# EAGLE board RAMBo (EAGLE 6.5.0), part 1 of 2
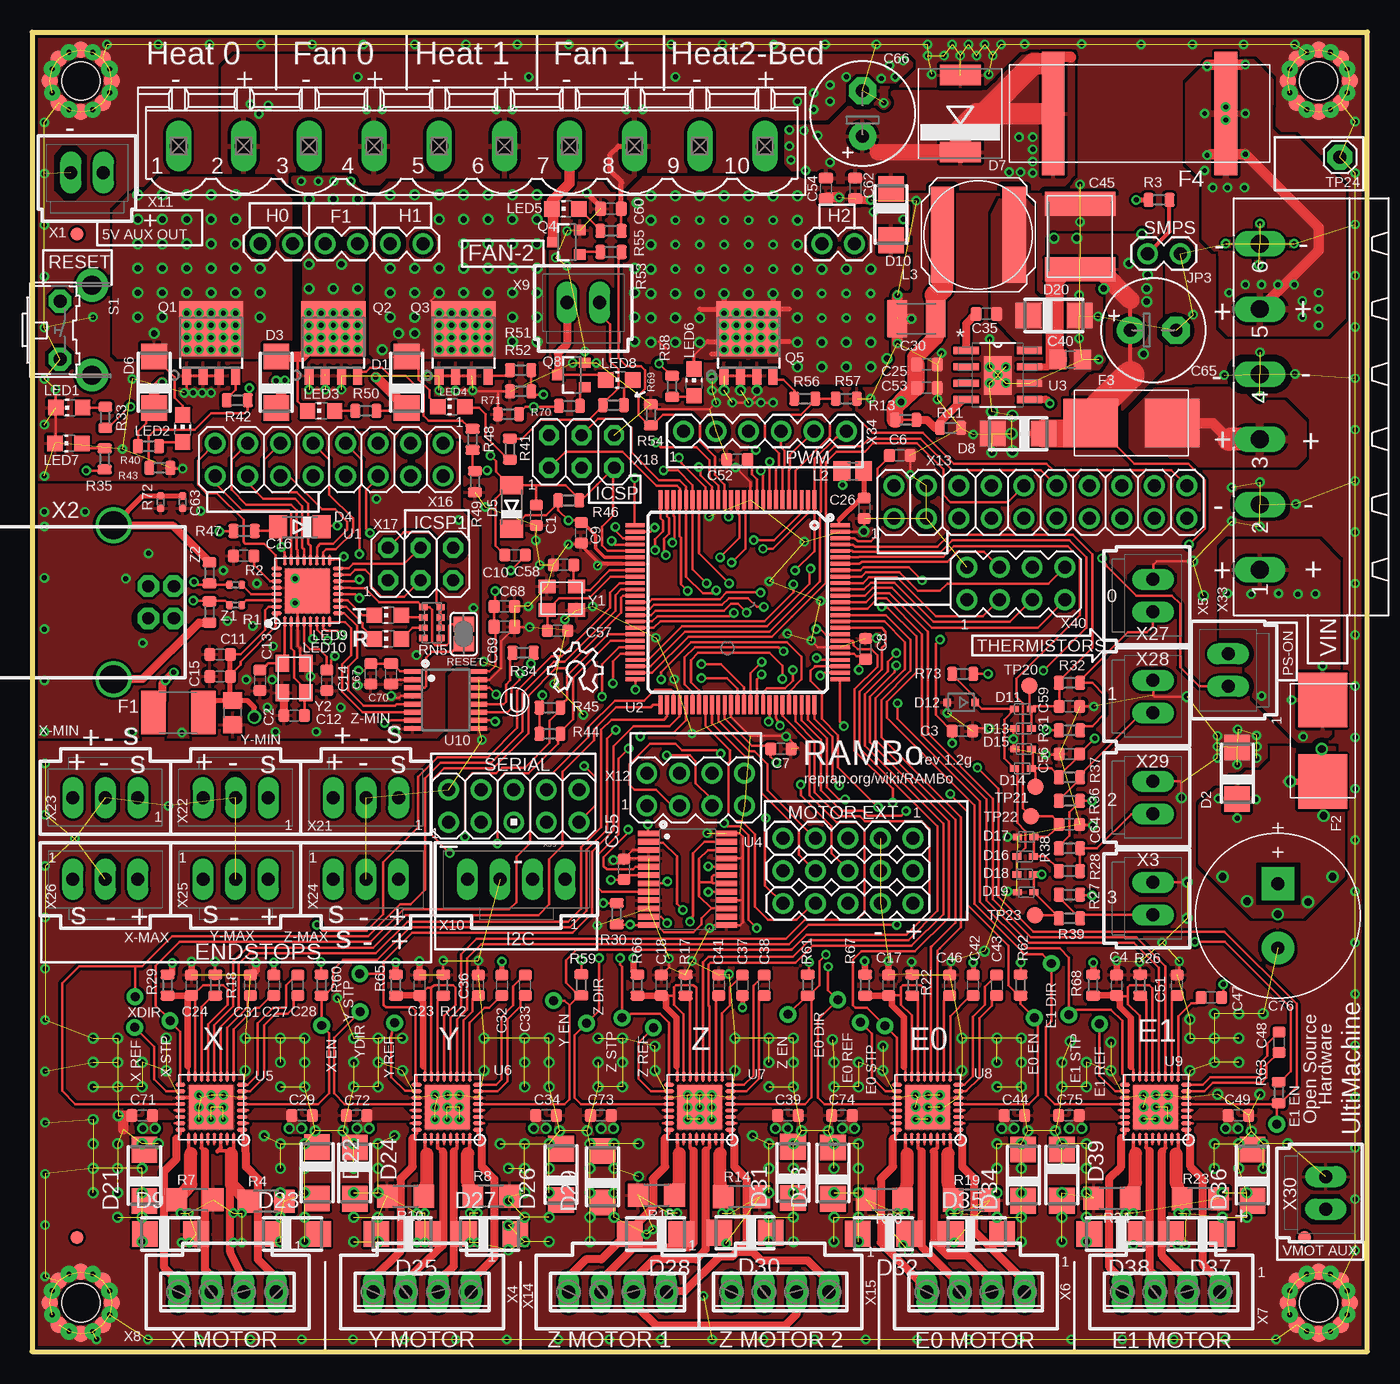
[diagram p2: board, top side]
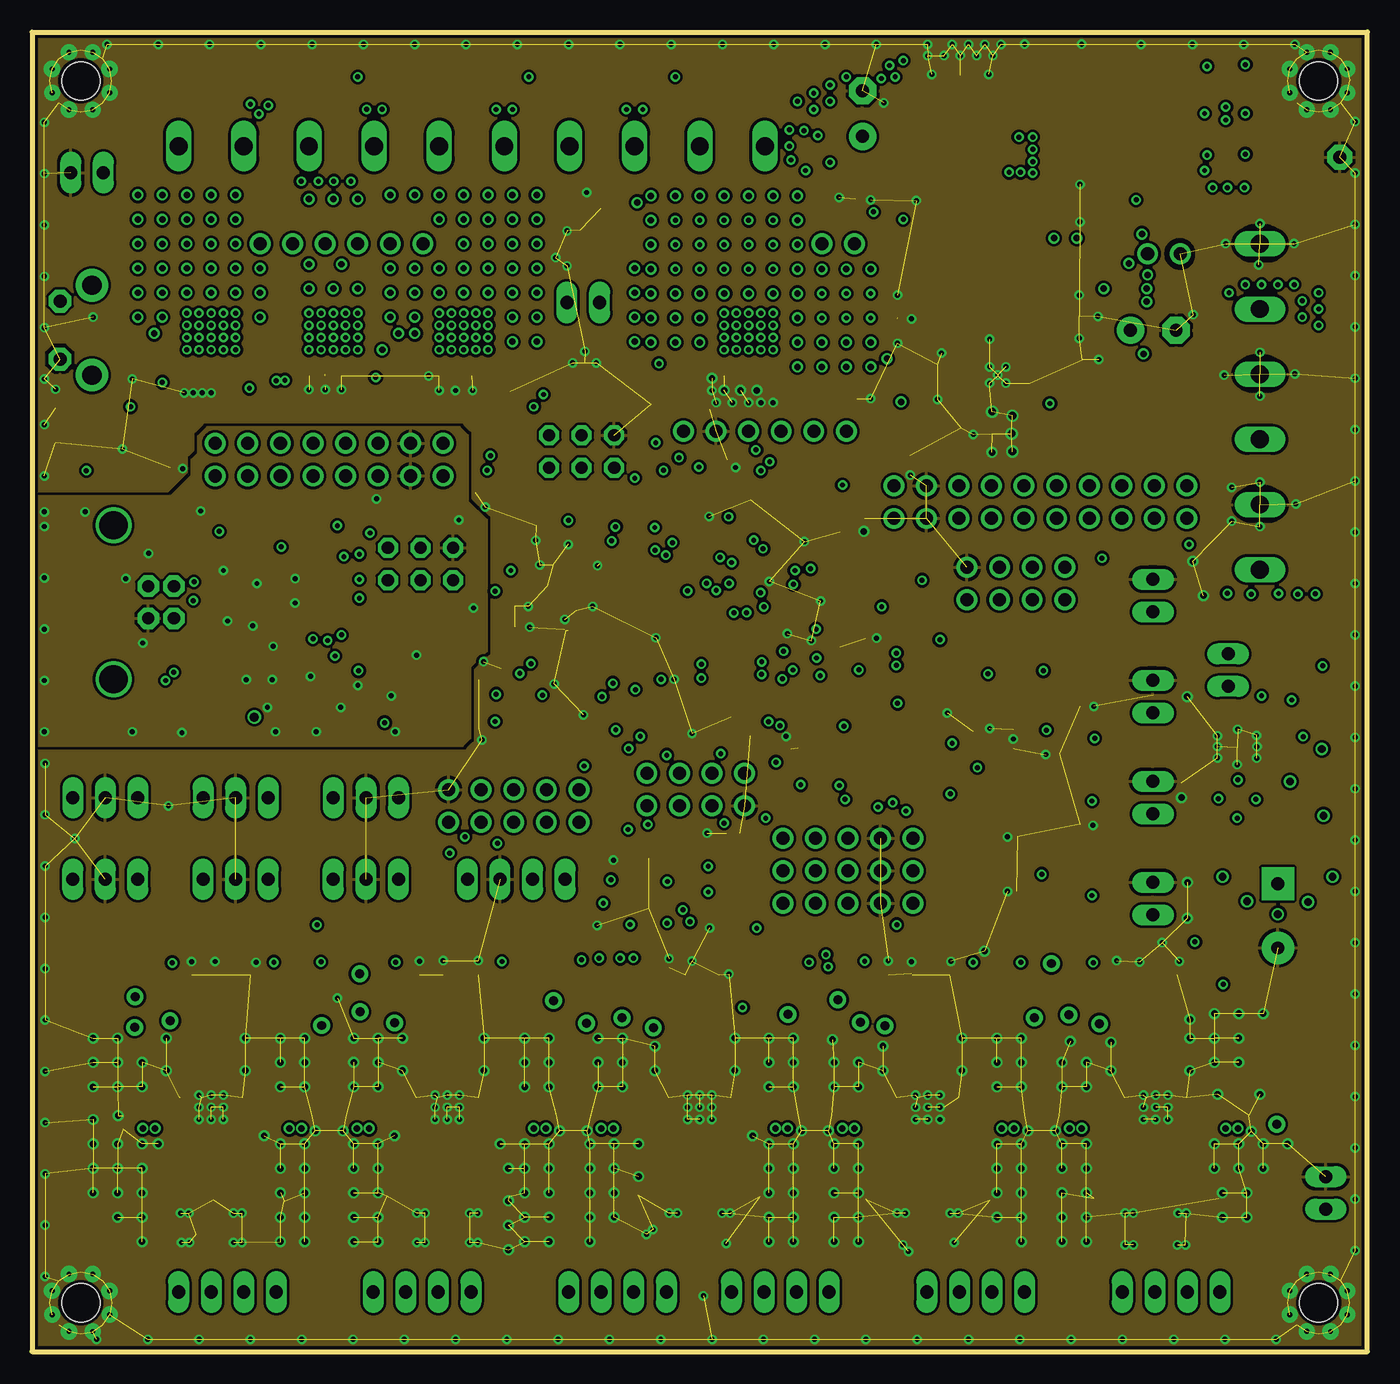
[diagram p3: board, inner layer 2-GND]
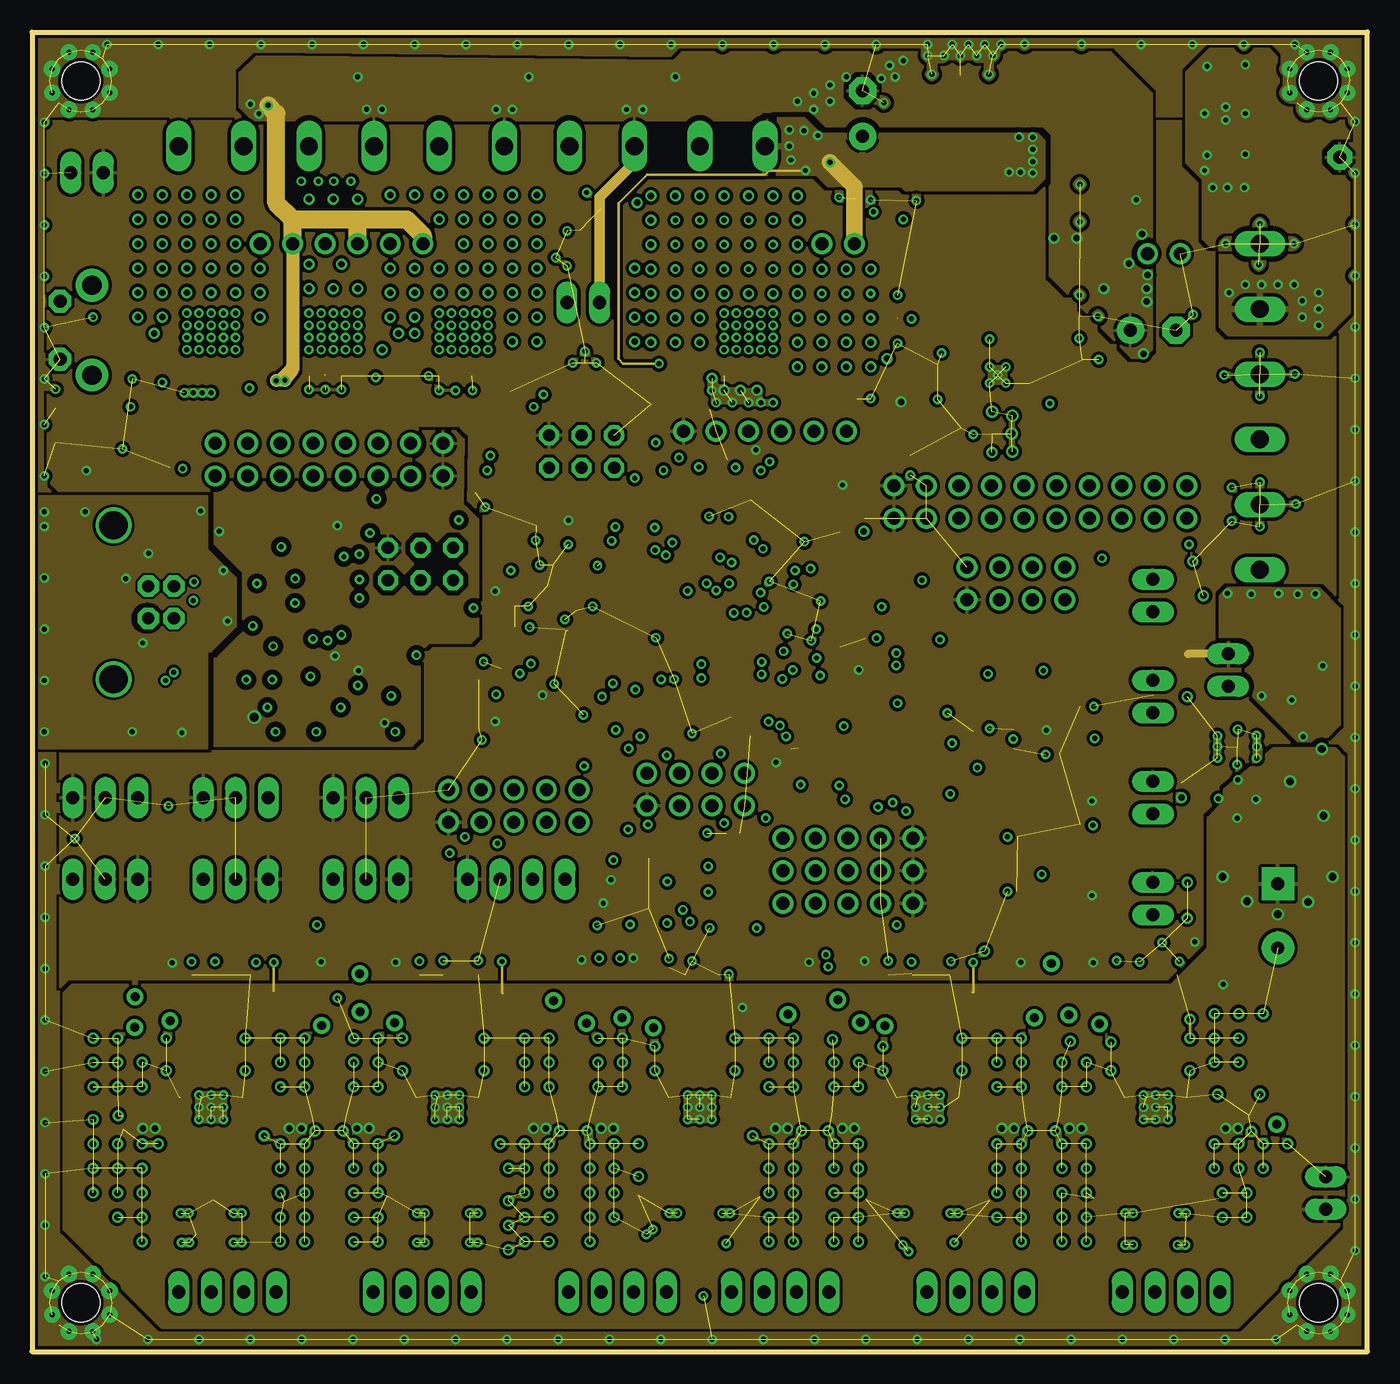
[diagram p4: board, inner layer 15-SUPPLY]
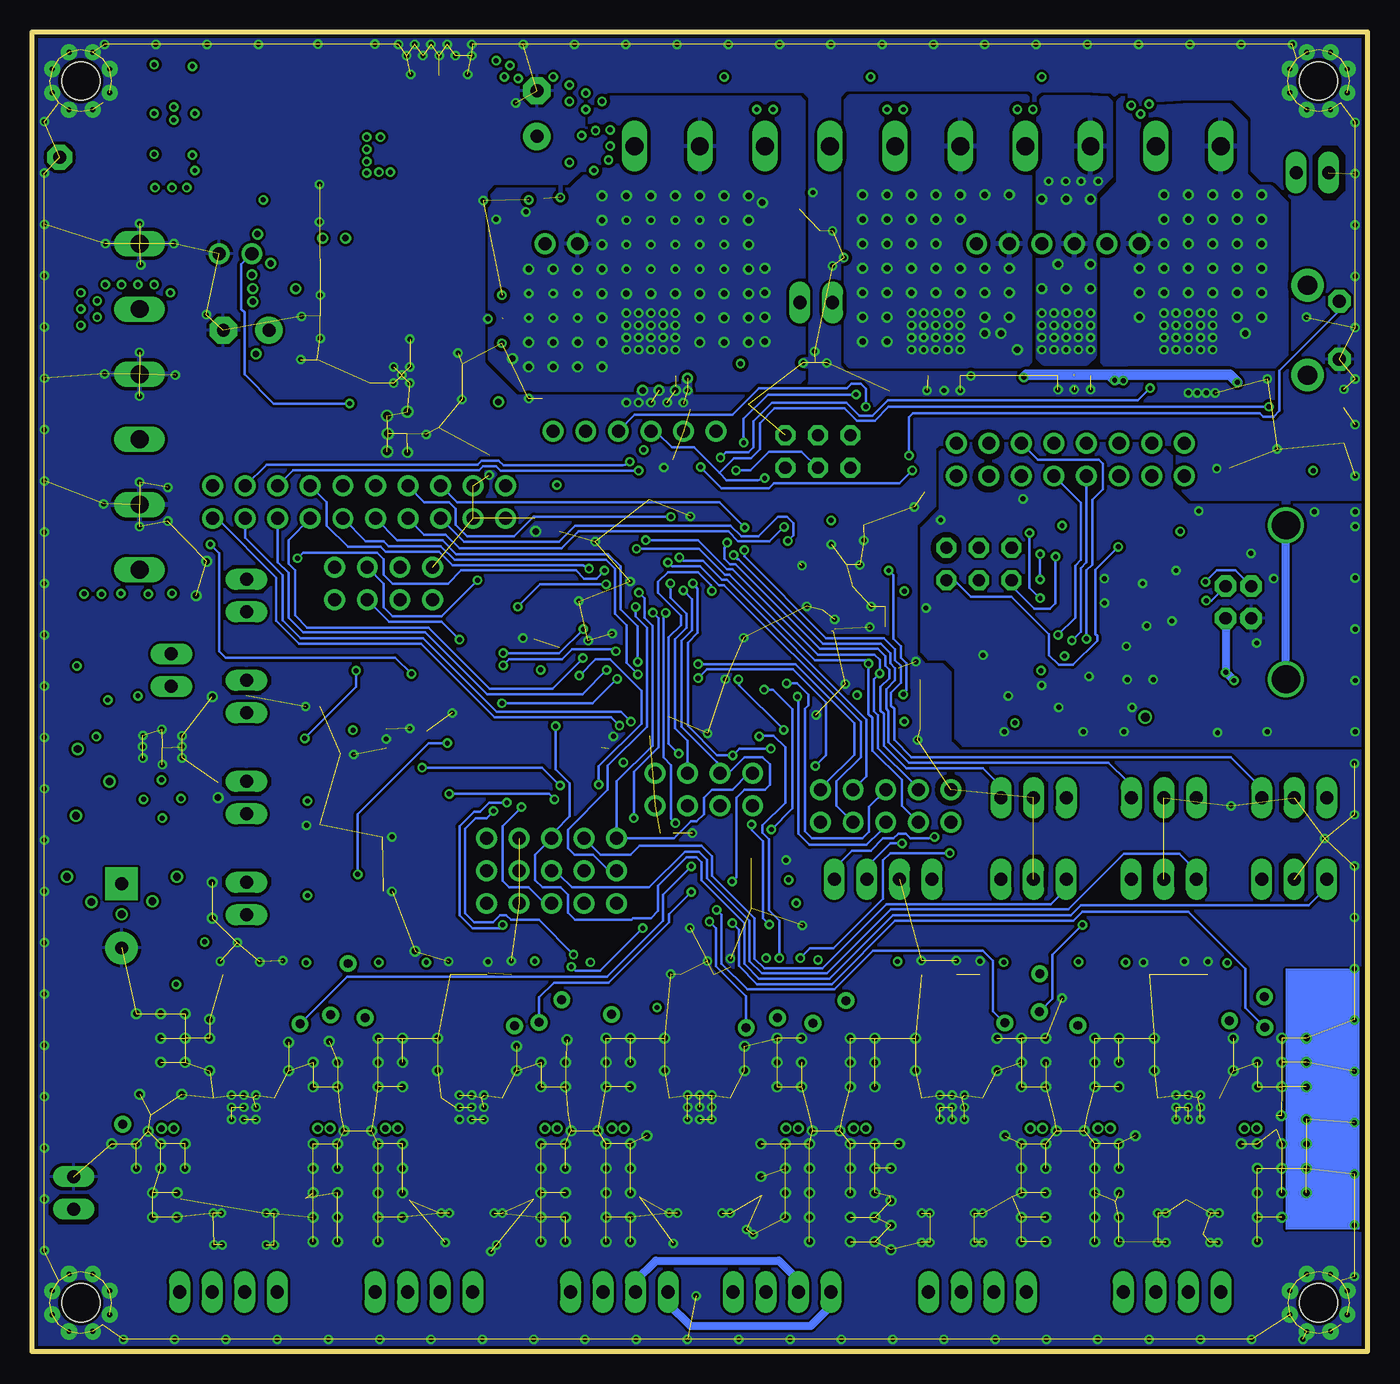
[diagram p5: board, bottom side, seen from below]

Size 104.14 x 102.87 mm. Coordinates in mm from the lower left corner, seen from the top.
Outline: 0,0 104.14,0 104.14,102.87 0,102.87 0,0
Copper layers (1*2+15*16): Top 0.07mm / dielectric 0.6mm / 2-GND 0.035mm / dielectric 0.2mm / 15-SUPPLY 0.035mm / dielectric 0.6mm / Bottom 0.07mm
Design rules "rambo4layer1-2f": minimum track width 7mil, minimum drill 15mil, track to track 7mil, track to pad 7mil, pad to pad 7mil, via to via 7mil, smd to smd 7mil, copper to edge 10mil, drill to drill 8mil, minimum pad ring 12mil, minimum via ring 7mil, stop-mask expansion 3mil, vias tented up to drill 25mil, thermal gap 10mil
Net classes: 0 default: width 0.178 mm, drill 0.381 mm, clearance 0.178 mm; 1 power: width 0.203 mm, drill 0.381 mm, clearance 0.178 mm; 2 gnd: width 0.203 mm, drill 0.381 mm, clearance 0.178 mm; 3 power usb: width 0.203 mm, drill 0.381 mm, clearance 0.178 mm
tRestrict: area 93.5,75 to 98,77.4

## Footprints (pad centres in the part's own frame; a part is rotated, then mirrored left to right if it is on the bottom)
C0603 = smd 0.85 x 1: 1 -0.8,0; 2 0.8,0
C0805 = smd 1.3 x 1.5: 1 -0.95,0; 2 0.95,0
C0603' = smd 0.85 x 1.1: 1 -0.8,0; 2 0.8,0
C1210K = smd 1.5 x 2.9: 1 -1.5,0; 2 1.5,0
C2220K = smd 1.85 x 5.5: 1 -2.55,0; 2 2.55,0
C0402 = smd 0.55 x 0.6: 1 -0.475,0; 2 0.475,0
E3,5-8 = drill 1 pad 2.134: + -1.778,0 | drill 1 pad 2.134 octagon: - 1.778,0
C12,5-5 = drill 1 pad 2.54 square: + 2.5,0 | drill 1 pad 2.54: - -2.5,0
SMA-SM = smd 2 x 2: A 2,0; C -2,0
MINIMELF = smd 1.4 x 1.8: A 1.7,0; C -1.7,0
DO-214AB = smd 1.6 x 3.2: A 3,0; C -3,0
SOD523 = smd 0.7 x 0.5: A 0.7,0; C -0.6,0
SOD323-R = smd 0.6 x 0.6: A 1.1,0; C -1.1,0
L1812 = smd 1.9 x 3.4: 1 -1.95,0; 2 1.95,0
OMNI-BLOK = smd 4.24 x 3.81: P$1 3.185,0; P$2 -3.185,0
FUSE-ATO-SMD = smd 1.778 x 9.652: P$1 -6.731,0; P$2 6.731,0
FIDUCIAL-1X2 = smd 1 x 1: 1 0,0
3,0-WAVE-HOLE = smd 1.27 x 1.27: P$1 0,2.413; P$2 2.413,0; P$3 0,-2.413; P$4 -2.413,0; P$5 1.714,1.714; P$6 -1.714,1.714; P$7 1.714,-1.714; P$8 -1.714,-1.714 | drill 0.381 pad 1.27: P$17 -2.248,0.933; P$18 -0.927,2.242; P$19 0.921,2.242; P$20 2.235,0.927; P$21 2.242,-0.921; P$22 0.927,-2.242; P$23 -0.927,-2.235; P$24 -2.242,-0.921 | hole 3: 0,0
SJ = smd 1.168 x 1.6: 1 -0.762,0; 2 0.762,0
1X02 = drill 1.016: 1 0,0; 2 2.54,0
C0805' = smd 1.3 x 1.5: 1 -0.85,0; 2 0.85,0
NR8040 = smd 1.8 x 7.5: P$1 -2.8,0; P$2 2.8,0
CHIP-LED0805 = smd 1.2 x 1.2: A 0,-1.05; C 0,1.05
SOT669 = smd 0.7 x 1.4: 1 -1.905,-2.55; 2 -0.635,-2.55; 3 0.635,-2.55; 4 1.905,-2.55 | smd 5 x 4.3: MB 0,1.1
SOT23-3 = smd 0.8 x 0.9: 1 -0.95,-1; 2 0.95,-1; 3 0,1.1
R0402 = smd 0.54 x 0.6: 1 -0.48,0; 2 0.48,0
R0603 = smd 0.79 x 1.1: 1 -0.82,0; 2 0.82,0
R1206 = smd 1.6 x 1.803: 1 -1.422,0; 2 1.422,0
CAY16 = smd 0.5 x 0.65: 1 -1.2,-0.675; 2 -0.4,-0.675; 3 0.4,-0.675; 4 1.2,-0.675; 5 1.2,0.675; 6 0.4,0.675; 7 -0.4,0.675; 8 -1.2,0.675
B3F-31XX = drill 1.016 pad 1.778 octagon: 1 -2.261,-1.245; 2 2.261,-1.245 | drill 1.499 pad 2.54: 3 -3.505,1.245; 4 3.505,1.245
B1,27TH = drill 0.7 pad 1.27: TP 0,0
B1,27 = smd 1.27 x 1.27: TP 0,0
1X01 = drill 1.016 pad 1.93 octagon: 1 0,0
QFN32TROUND = smd 0.8 x 0.28: 1 -2.4,1.75; 2 -2.4,1.25; 3 -2.4,0.75; 4 -2.4,0.25; 5 -2.4,-0.25; 6 -2.4,-0.75; 7 -2.4,-1.25; 8 -2.4,-1.75; 17 2.4,-1.75; 18 2.4,-1.25; 19 2.4,-0.75; 20 2.4,-0.25; 21 2.4,0.25; 22 2.4,0.75; 23 2.4,1.25; 24 2.4,1.75 | smd 0.28 x 0.8: 9 -1.75,-2.4; 10 -1.25,-2.4; 11 -0.75,-2.4; 12 -0.25,-2.4; 13 0.25,-2.4; 14 0.75,-2.4; 15 1.25,-2.4; 16 1.75,-2.4; 25 1.75,2.4; 26 1.25,2.4; 27 0.75,2.4; 28 0.25,2.4; 29 -0.25,2.4; 30 -0.75,2.4; 31 -1.25,2.4; 32 -1.75,2.4 | smd 3.465 x 3.465: 33 0,0
TQFP100 = smd 1.5 x 0.3: 1 -8,6; 2 -8,5.5; 3 -8,5; 4 -8,4.5; 5 -8,4; 6 -8,3.5; 7 -8,3; 8 -8,2.5; 9 -8,2; 10 -8,1.5; 11 -8,1; 12 -8,0.5; 13 -8,0; 14 -8,-0.5; 15 -8,-1; 16 -8,-1.5; 17 -8,-2; 18 -8,-2.5; 19 -8,-3; 20 -8,-3.5; 21 -8,-4; 22 -8,-4.5; 23 -8,-5; 24 -8,-5.5; 25 -8,-6; 51 8,-6; 52 8,-5.5; 53 8,-5; 54 8,-4.5; 55 8,-4; 56 8,-3.5; 57 8,-3; 58 8,-2.5; 59 8,-2; 60 8,-1.5; 61 8,-1; 62 8,-0.5; 63 8,0; 64 8,0.5; 65 8,1; 66 8,1.5; 67 8,2; 68 8,2.5; 69 8,3; 70 8,3.5; 71 8,4; 72 8,4.5; 73 8,5; 74 8,5.5; 75 8,6 | smd 0.3 x 1.5: 26 -6,-8; 27 -5.5,-8; 28 -5,-8; 29 -4.5,-8; 30 -4,-8; 31 -3.5,-8; 32 -3,-8; 33 -2.5,-8; 34 -2,-8; 35 -1.5,-8; 36 -1,-8; 37 -0.5,-8; 38 0,-8; 39 0.5,-8; 40 1,-8; 41 1.5,-8; 42 2,-8; 43 2.5,-8; 44 3,-8; 45 3.5,-8; 46 4,-8; 47 4.5,-8; 48 5,-8; 49 5.5,-8; 50 6,-8; 76 6,8; 77 5.5,8; 78 5,8; 79 4.5,8; 80 4,8; 81 3.5,8; 82 3,8; 83 2.5,8; 84 2,8; 85 1.5,8; 86 1,8; 87 0.5,8; 88 0,8; 89 -0.5,8; 90 -1,8; 91 -1.5,8; 92 -2,8; 93 -2.5,8; 94 -3,8; 95 -3.5,8; 96 -4,8; 97 -4.5,8; 98 -5,8; 99 -5.5,8; 100 -6,8
SOIC127P600X170-9N = smd 1.981 x 0.559: 1 -2.464,1.905; 2 -2.464,0.635; 3 -2.464,-0.635; 4 -2.464,-1.905; 5 2.464,-1.905; 6 2.464,-0.635; 7 2.464,0.635; 8 2.464,1.905 | smd 2.134 x 2.997: 9 0,-0.051
TSSOP24 = smd 1.635 x 0.44: P01 -3.05,3.575; P02 -3.05,2.925; P03 -3.05,2.275; P04 -3.05,1.625; P05 -3.05,0.975; P06 -3.05,0.325; P07 -3.05,-0.325; P08 -3.05,-0.975; P09 -3.05,-1.625; P10 -3.05,-2.275; P11 -3.05,-2.925; P12 -3.05,-3.575; P13 3.05,-3.575; P14 3.05,-2.925; P15 3.05,-2.275; P16 3.05,-1.625; P17 3.05,-0.975; P18 3.05,-0.325; P19 3.05,0.325; P20 3.05,0.975; P21 3.05,1.625; P22 3.05,2.275; P23 3.05,2.925; P24 3.05,3.575
QSOP16 = smd 0.381 x 1.27: 1 -2.223,-2.6; 2 -1.587,-2.6; 3 -0.953,-2.6; 4 -0.318,-2.6; 5 0.318,-2.6; 6 0.953,-2.6; 7 1.587,-2.6; 8 2.223,-2.6; 9 2.223,2.6; 10 1.587,2.6; 11 0.953,2.6; 12 0.318,2.6; 13 -0.318,2.6; 14 -0.953,2.6; 15 -1.587,2.6; 16 -2.223,2.6
70543-02 = drill 1.016 long: 1 -1.27,0; 2 1.27,0
PN61729 = drill 0.95 pad 1.676 octagon: 1 1.25,4.71; 2 -1.25,4.71; 3 -1.25,2.71; 4 1.25,2.71 | drill 2.2: P$1 -6,0; P$2 6,0
4POL254 = drill 1.016 long: 1 -3.81,0; 2 -1.27,0; 3 1.27,0; 4 3.81,0
70543-04 = drill 1.016 long: 1 -3.81,0; 2 -1.27,0; 3 1.27,0; 4 3.81,0
MSTBV10 = drill 1.397 long: 1 -22.86,0; 2 -17.78,0; 3 -12.7,0; 4 -7.62,0; 5 -2.54,0; 6 2.54,0; 7 7.62,0; 8 12.7,0; 9 17.78,0; 10 22.86,0
2X4 = drill 1.016: 1 -3.81,-1.27; 2 -3.81,1.27; 3 -1.27,-1.27; 4 -1.27,1.27; 5 1.27,-1.27; 6 1.27,1.27; 7 3.81,-1.27; 8 3.81,1.27
2X10 = drill 1.016: 1 -11.43,-1.27; 2 -11.43,1.27; 3 -8.89,-1.27; 4 -8.89,1.27; 5 -6.35,-1.27; 6 -6.35,1.27; 7 -3.81,-1.27; 8 -3.81,1.27; 9 -1.27,-1.27; 10 -1.27,1.27; 11 1.27,-1.27; 12 1.27,1.27; 13 3.81,-1.27; 14 3.81,1.27; 15 6.35,-1.27; 16 6.35,1.27; 17 8.89,-1.27; 18 8.89,1.27; 19 11.43,-1.27; 20 11.43,1.27
2X8 = drill 1.016: 1 0,0; 2 0,2.54; 3 2.54,0; 4 2.54,2.54; 5 5.08,0; 6 5.08,2.54; 7 7.62,0; 8 7.62,2.54; 9 10.16,0; 10 10.16,2.54; 11 12.7,0; 12 12.7,2.54; 13 15.24,0; 14 15.24,2.54; 15 17.78,0; 16 17.78,2.54
2X03 = drill 0.95 pad 1.55 octagon: 1 -2.54,-1.27; 2 -2.54,1.27; 3 0,-1.27; 4 0,1.27; 5 2.54,-1.27; 6 2.54,1.27
1X05 = drill 1.016: 1 0,0; 2 2.54,0; 3 5.08,0; 4 7.62,0; 5 10.16,0
70543-03 = drill 1.016 long: 1 -2.54,0; 2 0,0; 3 2.54,0
MSTBA6 = drill 1.397 long: 1 -12.7,5.08; 2 -7.62,5.08; 3 -2.54,5.08; 4 2.54,5.08; 5 7.62,5.08; 6 12.7,5.08
1X06 = drill 1.016: 1 0,0; 2 2.54,0; 3 5.08,0; 4 7.62,0; 5 10.16,0; 6 12.7,0
AVR_ICSP = drill 1.016: 1 -1.27,5.08; 2 1.27,5.08; 3 -1.27,2.54; 4 1.27,2.54; 5 -1.27,0; 6 1.27,0; 7 -1.27,-2.54; 8 1.27,-2.54; 9 -1.27,-5.08; 10 1.27,-5.08
CRYSTAL-3.2-2.5 = smd 1.3 x 1.05: 1 -1.15,-0.925; 2 1.15,-0.925; 3 1.15,0.925; 4 -1.15,0.925

## Placement (x,y rotation side)
C1  22pF  [C0603]  39.31,65.21 270 top
C2  10uF  [C0805]  15.65,49.82 90 top
C3  100nF  [C0603]  72.55,48.38 0 top
C4  100nF  [C0603]  84.58,28.57 90 top
C6  100nF  [C0603]  67.66,69.86 0 top
C7  100nF  [C0603]  58.39,46.99 0 top
C8  100nF  [C0603]  65,54.78 90 top
C9  100nF  [C0603]  42.82,63.84 270 top
C10  100nF  [C0603]  37.66,62.1 180 top
C11  100nF  [C0603]  14.67,54.36 180 top
C12  22pF  [C0603]  20.45,49.59 180 top
C13  22pF  [C0603]  17.78,52.32 270 top
C14  100nF  [C0603]  22.99,52.32 270 top
C15  100nF  [C0603]  14.67,52.64 180 top
C16  1uF  [C0603]  16.51,62.04 180 top
C17  100nF  [C0603]  66.8,28.57 90 top
C18  100nF  [C0603]  49.09,28.57 90 top
C23  100nF  [C0603]  30.23,28.57 90 top
C24  100nF  [C0603]  12.45,28.57 90 top
C25  100nF  [C0603']  69.79,76.96 0 top
C26  100nF  [C0603]  64.9,65.75 270 top
C27  100nF  [C0603]  18.86,28.57 270 top
C28  100nF  [C0603]  20.73,28.57 90 top
C29  100nF  [C0603]  21.05,18.41 0 top
C30  10uF  [C1210K]  68.96,80.52 180 top
C31  0.22uF  [C0603]  17.02,28.57 270 top
C32  100nF  [C0603]  36.64,28.57 270 top
C33  100nF  [C0603]  38.45,28.57 90 top
C34  100nF  [C0603]  40.1,18.41 0 top
C35  10nF  [C0603']  74.42,80.9 0 top
C36  0.22uF  [C0603]  34.8,28.57 270 top
C37  100nF  [C0603]  55.4,28.57 90 top
C38  100nF  [C0603]  57.09,28.57 90 top
C39  100nF  [C0603]  58.96,18.41 0 top
C40  1uF  [C0805]  80.96,77.34 0 top
C41  0.22uF  [C0603]  53.56,28.57 270 top
C42  100nF  [C0603]  73.38,28.57 270 top
C43  100nF  [C0603]  75.24,28.57 90 top
C44  100nF  [C0603]  76.61,18.41 0 top
C45  10uF  [C2220K]  81.72,86.93 90 top
C46  0.22uF  [C0603]  71.56,28.57 270 top
C47  100nF  [C0603]  91.95,27.62 180 top
C48  100nF  [C0603]  97.25,24.13 90 top
C49  100nF  [C0603]  94.08,18.41 0 top
C51  0.22uF  [C0603]  89.28,28.57 270 top
C52  100nF  [C0603]  54.99,69.53 180 top
C53  10nF  [C0603']  69.79,75.12 0 top
C54  10nF  [C0603']  61.91,90.68 270 top
C55  100nF  [C0603]  46.16,37.59 90 top
C56  100nF  [C0603]  80.9,46.6 180 top
C57  22pF  [C0603]  40.99,56.2 0 top
C58  22pF  [C0603]  41.43,61.34 180 top
C59  100nF  [C0603]  80.9,50.3 0 top
C60  100nF  [C0603']  45.15,89.09 180 top
C62  100nF  [C0603']  64.2,90.68 270 top
C63  4.7nF  [C0402]  11.75,66.23 270 top
C64  100nF  [C0603]  80.9,41.1 0 top
C65  100uF  [E3,5-8]  87.44,79.63 0 top
C66  100uF  [E3,5-8]  64.77,96.52 90 top
C67  100nF  [C0603]  26.42,52.83 90 top
C68  100nF  [C0603]  36.83,58.1 180 top
C69  10nF  [C0603']  36.83,56.52 0 top
C70  10nF  [C0603']  28,52.83 270 top
C71  100nF  [C0603]  8.6,18.41 180 top
C72  100nF  [C0603]  25.3,18.41 180 top
C73  100nF  [C0603]  44.35,18.41 180 top
C74  100nF  [C0603]  63.15,18.41 180 top
C75  100nF  [C0603]  80.87,18.41 180 top
C76  470uF  [C12,5-5]  97.16,33.97 90 top
D1  B240A-13-F  [SMA-SM]  29.21,75.56 90 top
D2  SK310A-TP  [SMA-SM]  93.98,45.09 90 top
D3  B240A-13-F  [SMA-SM]  19.05,75.56 90 top
D4  CD1206-S01575  [MINIMELF]  20.89,64.29 180 top
D5  CD1206-S01575  [MINIMELF]  37.4,65.85 90 top
D6  B240A-13-F  [SMA-SM]  9.53,75.56 90 top
D7  S3A  [DO-214AB]  72.39,96.52 90 top
D8  SK310A-TP  [SMA-SM]  76.9,71.56 180 top
D9  B240A-13-F  [SMA-SM]  10.79,9.17 0 top
D10  B240A-13-F  [SMA-SM]  66.99,88.65 270 top
D11  1N4148WT  [SOD523]  77.22,50.1 0 top
D12  SZMM3Z4V7T1G  [SOD323-R]  72.45,50.61 180 top
D13  1N4148WT  [SOD523]  77.34,48.58 180 top
D14  1N4148WT  [SOD523]  77.22,45.47 0 top
D15  1N4148WT  [SOD523]  77.34,46.99 180 top
D16  1N4148WT  [SOD523]  77.41,38.61 0 top
D17  1N4148WT  [SOD523]  77.53,40.13 180 top
D18  1N4148WT  [SOD523]  77.41,37.21 0 top
D19  1N4148WT  [SOD523]  77.53,35.81 180 top
D20  SK310A-TP  [SMA-SM]  79.69,80.77 0 top
D21  B240A-13-F  [SMA-SM]  8.76,13.74 90 top
D22  B240A-13-F  [SMA-SM]  22.23,13.94 270 top
D23  B240A-13-F  [SMA-SM]  20.32,9.17 0 top
D24  B240A-13-F  [SMA-SM]  25.17,13.92 270 top
D25  B240A-13-F  [SMA-SM]  28.85,9.17 180 top
D26  B240A-13-F  [SMA-SM]  41.25,13.82 90 top
D27  B240A-13-F  [SMA-SM]  35.69,9.17 0 top
D28  B240A-13-F  [SMA-SM]  48.62,9.17 180 top
D29  B240A-13-F  [SMA-SM]  44.5,13.64 90 top
D30  B240A-13-F  [SMA-SM]  55.6,9.27 180 top
D31  B240A-13-F  [SMA-SM]  59.33,13.97 90 top
D32  B240A-13-F  [SMA-SM]  66.4,9.19 180 top
D33  B240A-13-F  [SMA-SM]  62.46,13.92 90 top
D34  B240A-13-F  [SMA-SM]  77.29,13.77 90 top
D35  B240A-13-F  [SMA-SM]  73.66,9.17 0 top
D36  B240A-13-F  [SMA-SM]  95.17,13.77 90 top
D37  B240A-13-F  [SMA-SM]  90.81,9.17 180 top
D38  B240A-13-F  [SMA-SM]  84.45,9.17 180 top
D39  B240A-13-F  [SMA-SM]  80.31,13.77 270 top
F1  MF-MSMF050-2 500mA  [L1812]  11.4,49.82 180 top
F2  OMNI-BLOK  [OMNI-BLOK]  100.65,47.62 90 top
F3  OMNI-BLOK  [OMNI-BLOK]  85.72,72.39 0 top
F4  FUSE  [FUSE-ATO-SMD]  86.36,96.52 180 top
FID1  FIDUCIAL1X2  [FIDUCIAL-1X2]  3.49,87.12 0 top
FID2  FIDUCIAL1X2  [FIDUCIAL-1X2]  3.49,8.89 0 top
FID3  FIDUCIAL1X2  [FIDUCIAL-1X2]  99.25,8.89 0 top
H1  WAVE-HOLE  [3,0-WAVE-HOLE]  3.81,3.81 0 top
H2  WAVE-HOLE  [3,0-WAVE-HOLE]  100.33,3.81 0 top
H3  WAVE-HOLE  [3,0-WAVE-HOLE]  3.81,99.06 0 top
H4  WAVE-HOLE  [3,0-WAVE-HOLE]  100.33,99.06 0 top
JP2  [SJ]  33.66,55.94 270 top
JP3  [1X02]  89.53,85.6 180 top
L2  10uH  [C0805']  64.01,68.64 0 top
L3  33uH  [NR8040]  73.79,87.06 180 top
LED1  YELLOW  [CHIP-LED0805]  2.9,73.59 90 top
LED2  RED  [CHIP-LED0805]  11.75,71.95 0 top
LED3  RED  [CHIP-LED0805]  22.54,73.34 90 top
LED4  RED  [CHIP-LED0805]  32.7,73.66 90 top
LED5  RED  [CHIP-LED0805]  41.59,89.09 90 top
LED6  RED  [CHIP-LED0805]  51.63,75.56 0 top
LED7  GREEN  [CHIP-LED0805]  2.84,70.8 90 top
LED8  RED  [CHIP-LED0805]  45.78,75.76 90 top
LED9  YELLOW  [CHIP-LED0805]  27.75,57.4 90 top
LED10  YELLOW  [CHIP-LED0805]  27.75,55.56 90 top
LOGO1  OSHW_LOGO_8MILX0150-NT  [OSHW_8X150_NOTEXT]  40.26,51.44 0 top
Q1  PSMN7R0-60YS  [SOT669]  13.97,78.64 0 top
Q2  PSMN7R0-60YS  [SOT669]  23.5,78.64 0 top
Q3  PSMN7R0-60YS  [SOT669]  33.66,78.64 0 top
Q4  IRLML6346TRPBF  [SOT23-3]  41.72,86.49 90 top
Q5  PSMN7R0-60YS  [SOT669]  55.88,78.64 0 top
Q8  IRLML6346TRPBF  [SOT23-3]  42.1,76.14 90 top
R1  22R  [R0402]  15.88,58.2 0 top
R2  22R  [R0402]  15.88,59.79 0 top
R3  470K  [R0603]  87.88,89.79 180 top
R4  0r1  [R1206]  18.25,11.72 0 top
R7  0r1  [R1206]  12.71,11.83 0 top
R8  0r1  [R1206]  35.8,12.12 0 top
R10  0r1  [R1206]  29.12,12.12 180 top
R11  NP  [R0603]  71.63,72.01 0 top
R12  0r  [R0603]  32.07,28.57 270 top
R13  NP  [R0603]  68.14,72.64 180 top
R14  0r1  [R1206]  55.33,12.07 0 top
R15  0r1  [R1206]  48.68,12.2 180 top
R17  0r  [R0603]  50.96,28.57 270 top
R18  0r  [R0603]  14.29,28.57 270 top
R19  0r1  [R1206]  73.27,11.82 0 top
R20  0r1  [R1206]  66.46,11.89 180 top
R22  0r  [R0603]  68.64,28.57 270 top
R23  0r1  [R1206]  91.12,11.92 0 top
R24  0r1  [R1206]  84.21,11.97 180 top
R26  0r  [R0603]  86.42,28.57 270 top
R27  4K7  [R0603]  80.9,35.62 0 top
R28  4K7  [R0603]  80.9,37.47 0 top
R29  56r  [R0603]  10.57,28.57 90 top
R30  3.3K  [R0603]  45.59,34.14 270 top
R31  4K7  [R0603]  80.9,48.44 180 top
R32  4K7  [R0603]  80.9,52.13 0 top
R33  1K  [R0603]  5.71,72.83 90 top
R34  1K  [R0603]  38.29,54.48 0 top
R35  1K  [R0603]  5.67,69.59 90 top
R36  4K7  [R0603]  80.9,42.94 0 top
R37  4K7  [R0603]  80.9,44.77 0 top
R38  4K7  [R0603]  80.9,39.23 180 top
R39  4K7  [R0603]  80.9,33.78 0 top
R40  1.8K  [R0603]  9.08,70.58 180 top
R41  1.8K  [R0603]  37.27,70.36 90 top
R42  10r  [R0603]  16,74.17 180 top
R43  100K  [R0603]  9.97,68.9 0 top
R44  10K  [R0603]  40.39,48.16 180 top
R45  10K  [R0603]  40.39,50.2 180 top
R46  10K  [R0603]  41.85,66.36 180 top
R47  10K  [R0603]  16.54,63.98 180 top
R48  10r  [R0603]  34.35,71.12 90 top
R49  100K  [R0603]  34.54,67.82 270 top
R50  1.8K  [R0603]  26.04,73.34 0 top
R51  10r  [R0603]  38.1,76.52 180 top
R52  100K  [R0603]  38.1,74.87 180 top
R53  10r  [R0603]  45.15,85.72 180 top
R54  100K  [R0603]  48.26,73.03 90 top
R55  1.8K  [R0603]  45.15,87.38 0 top
R56  10r  [R0603]  60.26,74.3 180 top
R57  100K  [R0603]  63.5,74.3 0 top
R58  1.8K  [R0603]  49.91,75.25 90 top
R59  100K  [R0603]  42.83,28.59 270 top
R60  100K  [R0603]  22.58,28.57 270 top
R61  100K  [R0603]  60.49,28.57 270 top
R62  100K  [R0603]  77.09,28.57 270 top
R63  100K  [R0603]  97.22,20.19 270 top
R65  56r  [R0603]  28.38,28.57 90 top
R66  56r  [R0603]  47.21,28.57 90 top
R67  56r  [R0603]  64.96,28.57 90 top
R68  56r  [R0603]  82.74,28.57 90 top
R69  1.8K  [R0603]  45.34,73.79 180 top
R70  10r  [R0603]  41.91,73.72 0 top
R71  100K  [R0603]  37.15,73.09 180 top
R72  1M  [R0402]  10.03,66.23 90 top
R73  10K  [R0603]  72.58,52.83 0 top
RN5  1k  [CAY16]  31.18,56.83 90 top
S1  [B3F-31XX]  3.43,79.63 270 top
TP0  PTR1B1,27TH  [B1,27TH]  25.58,26.51 0 top
TP1  PTR1B1,27TH  [B1,27TH]  8.03,27.67 0 top
TP2  PTR1B1,27TH  [B1,27TH]  10.76,25.79 0 top
TP3  PTR1B1,27TH  [B1,27TH]  8,25.27 0 top
TP4  PTR1B1,27TH  [B1,27TH]  22.59,25.43 0 top
TP5  PTR1B1,27TH  [B1,27TH]  25.56,29.46 0 top
TP6  PTR1B1,27TH  [B1,27TH]  28.28,25.62 0 top
TP7  PTR1B1,27TH  [B1,27TH]  40.67,27.37 0 top
TP8  PTR1B1,27TH  [B1,27TH]  46.01,26.01 0 top
TP9  PTR1B1,27TH  [B1,27TH]  48.45,25.24 0 top
TP10  PTR1B1,27TH  [B1,27TH]  58.96,26.29 0 top
TP11  PTR1B1,27TH  [B1,27TH]  62.83,27.43 0 top
TP12  PTR1B1,27TH  [B1,27TH]  64.59,25.66 0 top
TP13  PTR1B1,27TH  [B1,27TH]  66.52,25.39 0 top
TP14  PTR1B1,27TH  [B1,27TH]  78.17,26.04 0 top
TP15  PTR1B1,27TH  [B1,27TH]  79.49,30.26 0 top
TP16  PTR1B1,27TH  [B1,27TH]  80.86,26.25 0 top
TP17  PTR1B1,27TH  [B1,27TH]  83.25,25.55 0 top
TP18  PTR1B1,27TH  [B1,27TH]  97.07,17.72 0 top
TP19  PTR1B1,27TH  [B1,27TH]  43.23,25.59 0 top
TP20  PTR1B1,27  [B1,27]  77.76,51.92 0 top
TP21  PTR1B1,27  [B1,27]  78.25,44.05 0 top
TP22  PTR1B1,27  [B1,27]  77.91,41.73 0 top
TP23  PTR1B1,27  [B1,27]  78.2,34.01 0 top
TP24  GND  [1X01]  101.99,93.12 0 top
U1  ATMEGA32U2-MUR  [QFN32TROUND]  21.46,59.31 90 top
U2  ATMEGA2560-16AU  [TQFP100]  55.02,58.42 270 top
U3  LM22675  [SOIC127P600X170-9N]  75.31,76.14 0 top
U4  AD5206  [TSSOP24]  51.12,36.83 0 top
U5  A4982  [QFN32TROUND]  13.97,19.05 180 top
U6  A4982  [QFN32TROUND]  32.38,19.05 180 top
U7  A4982  [QFN32TROUND]  52.07,19.05 180 top
U8  A4982  [QFN32TROUND]  69.85,19.05 180 top
U9  A4982  [QFN32TROUND]  87.63,19.05 180 top
U10  ADUM7441  [QSOP16]  32.26,50.8 270 top
X1  C-GRID-02-70543  [70543-02]  4.29,91.92 0 top
X2  USB B-TH  [PN61729]  6.35,58.42 270 top
X3  C-GRID-02-70543  [70543-02]  87.41,35.31 270 top
X4  C-GRID-04-70543  [4POL254]  30.41,4.65 180 top
X5  C-GRID-02-70543  [70543-02]  93.27,53.13 90 top
X6  C-GRID-04-70543  [4POL254]  73.59,4.65 180 top
X7  C-GRID-04-70543  [4POL254]  88.83,4.65 180 top
X8  C-GRID-04-70543  [4POL254]  15.24,4.65 180 top
X9  C-GRID-02-70543  [70543-02]  42.99,81.79 0 top
X10  C-GRID-04-70543  [70543-04]  37.76,36.83 0 top
X11  MSTBV10  [MSTBV10]  34.29,93.98 0 top
X12  SPI  [2X4]  51.75,43.81 0 top
X13  EXT-2  [2X10]  78.63,66.22 0 top
X14  C-GRID-04-70543  [4POL254]  45.65,4.65 180 top
X15  C-GRID-04-70543  [4POL254]  58.35,4.65 180 top
X16  32u2 EXT  [2X8]  32.07,70.8 180 top
X17  3x2M  [2X03]  30.29,61.4 0 top
X18  3x2M  [2X03]  42.86,70.17 0 top
X20  MX1  [1X05]  68.71,34.94 180 top
X21  C-GRID-03-70543  [70543-03]  26.04,43.18 180 top
X22  C-GRID-03-70543  [70543-03]  15.88,43.18 180 top
X23  C-GRID-03-70543  [70543-03]  5.71,43.18 180 top
X24  C-GRID-03-70543  [70543-03]  26.04,36.83 0 top
X25  C-GRID-03-70543  [70543-03]  15.88,36.83 0 top
X26  C-GRID-03-70543  [70543-03]  5.71,36.83 0 top
X27  C-GRID-02-70543  [70543-02]  87.41,58.93 270 top
X28  C-GRID-02-70543  [70543-02]  87.41,51.06 270 top
X29  C-GRID-02-70543  [70543-02]  87.41,43.19 270 top
X30  C-GRID-02-70543  [70543-02]  100.89,12.38 270 top
X31  MX2  [1X05]  68.71,37.48 180 top
X32  MX3  [1X05]  68.71,40.02 180 top
X33  MSTBA6  [MSTBA6]  100.84,73.66 90 top
X34  PWM_EXT  [1X06]  50.8,71.75 0 top
X35  [1X02]  17.78,86.36 0 top
X36  [1X02]  22.86,86.36 0 top
X37  [1X02]  27.94,86.36 0 top
X38  [1X02]  61.59,86.36 0 top
X39  M05X2PTH  [AVR_ICSP]  37.56,42.55 90 top
X40  Analog  [2X4]  76.73,59.87 0 top
Y1  16MHz KX-7  [CRYSTAL-3.2-2.5]  41.31,58.74 0 top
Y2  16MHz KX-7  [CRYSTAL-3.2-2.5]  20.45,52.51 270 top
Z1  CG0603MLC-05E  [R0603]  13.84,57.66 90 top
Z2  CG0603MLC-05E  [R0603]  13.84,60.71 270 top

## Tracks (layer width: path | path; a pad name or v marks a point on that pad's centre or on a via)
+12V  (via drill 0.38, 0.5, 0.6)
  Top 0.203: C47.1 92.89,27.71 v92.89,28.64
  Top 0.406: C32.1 v36.64,30.41 | C37.1 v55.4,26.83 | v18.86,30.35 C27.1 | v73.39,30.35 73.39,29.44 C42.1
  Top 0.508: 97.78,44.44 F2.P$2
  15-SUPPLY 0.203: v18.86,30.35 18.86,28.13 | v36.64,30.41 36.64,28 36.7,27.94 | v73.39,30.35 73.39,28.02 73.41,28 73.34,28
  other vias: 99.5,35.05 95.44,43.05 98.11,44.45 100.71,41.78 100.58,46.99 93.98,41.59 94.04,44.58 21.02,17.4 8.64,17.4 40.07,17.4 25.34,17.4 58.93,17.4 44.39,17.4 76.58,17.4 63.18,17.4 80.9,17.4 94.04,17.4 101.41,37.02 94.74,35.12 92.84,37.02 97.16,34.1 92.52,43.12 9.59,17.4 20.07,17.4 26.29,17.4 39.12,17.4 45.34,17.4 57.98,17.4 64.14,17.4 75.63,17.4 81.85,17.4 93.09,17.4
  pour 15-SUPPLY (isolate 0.254, rank 2): 96.84,46.99 101.6,46.99 102.23,46.35 102.23,10.16 93.98,1.91 10.16,1.91 2.54,9.53 2.54,27.94 3.17,28.57 88.9,28.57 91.76,31.43 91.76,41.59 93.03,42.86 93.03,43.81
  pour Top (isolate 0.406, rank 2): 101.6,46.99 96.2,46.99 91.12,42.55 91.12,38.1 95.25,33.97 99.06,33.97 102.23,37.15 102.23,46.35
  pour Top (no thermals): 8.64,17.08 9.59,17.08 9.72,17.21 9.72,18.03 9.84,18.16 10.99,18.16 11.11,18.29 11.81,18.3 11.13,18.3 10.54,18.86 9.91,18.86 9.72,18.67 9.46,18.67 8.45,17.65 8.45,17.27
  pour Top (no thermals): 21.11,17.12 21.06,17.07 20.14,17.07 19.96,17.25 19.96,18.03 19.84,18.16 16.99,18.16 16.87,18.29 16.26,18.29 16.28,18.31 16.79,18.31 17.4,18.92 19.66,18.92 19.71,18.92 20.07,18.57 20.29,18.57 21.26,17.6 21.26,17.25 21.11,17.09
  pour Top (no thermals): 25.1,17.32 25.35,17.07 26.29,17.07 26.42,17.2 26.42,18.01 26.54,18.14 29.36,18.14 29.51,18.29 30.1,18.29 30.07,18.31 29.54,18.31 28.88,18.97 26.62,18.97 25.1,17.6
  pour Top (no thermals): 40.16,17.09 40.13,17.07 39.14,17.07 39.01,17.2 39.01,18.01 38.89,18.14 35.43,18.14 35.28,18.29 34.7,18.29 34.72,18.31 35.26,18.31 35.94,19 38.63,19 39.19,18.44 39.47,18.44 40.31,17.6 40.31,17.22 40.18,17.09
  pour Top (no thermals): 44.4,17.07 45.24,17.07 45.42,17.25 45.42,18.01 45.49,18.08 45.57,18.16 49.02,18.16 49.15,18.29 49.83,18.29 49.81,18.31 49.17,18.31 48.49,19 45.85,19 45.75,19 45.39,18.64 45.19,18.64 44.15,17.6 44.15,17.32
  pour Top (no thermals): 59.11,17.12 59.05,17.07 57.89,17.07 57.86,17.09 57.86,17.96 57.68,18.14 55.14,18.14 54.99,18.29 54.38,18.29 54.41,18.31 54.97,18.31 55.6,18.95 57.53,18.95 57.61,18.95 58.19,18.36 58.42,18.36 59.18,17.6 59.18,17.2
  pour Top (no thermals): 63.25,17.07 64.16,17.07 64.24,17.14 64.24,17.98 64.39,18.14 66.85,18.14 67.01,18.29 67.61,18.29 67.59,18.31 66.95,18.31 66.29,18.97 64.49,18.97 63.96,18.44 63.75,18.44 62.97,17.65 62.97,17.27 63.14,17.09
  pour Top (no thermals): 76.63,17.07 75.67,17.07 75.54,17.2 75.54,18.01 75.41,18.14 72.82,18.14 72.67,18.29 72.14,18.29 72.16,18.31 72.64,18.31 73.28,18.95 75.21,18.95 75.26,18.95 75.77,18.44 76,18.44 76.83,17.6 76.83,17.27
  pour Top (no thermals): 94.03,17.07 93.17,17.07 93.04,17.2 92.99,17.25 92.99,18.01 92.86,18.14 90.65,18.14 90.5,18.29 89.92,18.29 89.94,18.31 90.47,18.31 91.11,18.95 92.71,18.95 92.76,18.95 93.27,18.44 93.47,18.44 94.28,17.63 94.28,17.32
  pour Top (no thermals): 80.9,17.07 81.84,17.07 81.89,17.12 81.92,17.14 81.92,17.98 82.04,18.11 84.61,18.11 84.79,18.29 85.37,18.29 85.34,18.31 84.76,18.31 84.05,19.02 82.3,19.02 82.25,19.02 81.69,18.47 81.51,18.47 80.7,17.65 80.7,17.25 80.87,17.07
+12V2  (via drill 0.38, 0.5)
  Top 0.203: R50.2 28.99,73.34 D1.C | X9.2 44.64,81.41 44.64,80.52 45.09,80.07 45.09,77.22 45.72,76.58 45.72,75.12 44.58,73.98 R69.2 44.52,73.73 43.43,72.64 39.69,72.64 38.22,71.18 R41.2 | D6.C 8.89,72.93 8.89,72.39 8.26,71.76 R40.2 | v90.23,62.93 91.44,64.14 91.44,67.94 90.17,69.22 85.98,69.22 83.76,71.44 83.49,71.44 F3.P$2 | v74.55,52.83 R73.2 | R55.2 45.95,87.4 C60.1
  Top 0.305: 85.66,76.15 C65.+ 85.66,81.98
  Top 0.406: C60.1 45.95,91.1 45.97,91.12 46,91.16 45.09,92.08 45.09,93.34 45.72,93.98 X11.8 | v86.11,89.79 R3.2
  Top 0.559: U3.7 79.18,76.77 79.38,76.9
  Top 0.61: 79.38,76.9 79.38,77.98 79.76,78.36
  Top 0.813: D3.C 19.43,73.95 19.43,75.5 v19.05,75.69 | D6.C 9.53,74.93 v10.16,75.56 | D1.C 26.83,75.95 v26.8,75.95 | 83.26,84.38 C45.1
  Top 1.422: 85.66,81.98 83.26,84.38 | C40.1 79.76,77.6 79.76,78.36 79.76,83.5 80.58,84.33 81.67,84.33 C45.1
  Top 2.184: D8.C 81.72,71.56 F3.P$2 82.55,73.03 85.66,76.15
  15-SUPPLY 0.254: X35.2 20.32,86.18
  15-SUPPLY 0.813: 46.99,92.84 X11.8 46.99,92.71 44.26,89.98 X9.2 44.26,82.55 | v19.72,75.72 19.53,76.04 20.32,76.83
  15-SUPPLY 1.016: 20.32,86.18 20.32,76.83 20.32,76.52 v19.72,75.72 v19.05,75.69
  15-SUPPLY 1.422: 20.32,88.27 19.05,89.53 19.05,96.52 v18.41,97.16 | 20.32,86.18 20.32,88.27 | 20.32,88.27 25.4,88.27 | 25.4,88.27 29.21,88.27 30.48,87 X37.2 | X36.2 25.4,88.27
  Bottom 0.203: v90.23,62.93 89.53,62.23 89.53,54.61 89.03,54.1 75.82,54.1 v74.55,52.83
  Bottom 0.813: v10.16,75.56 10.73,76.14 18.67,76.14 | 18.67,76.14 v19.72,75.72 20.13,76.14 | v26.8,75.95 26.61,76.14 18.67,76.14
  other vias: 17.69,96.5 17.03,97.25 36.2,96.84 37.47,96.84 46.35,96.84 63.5,99.38 50.16,99.38 38.73,99.38 25.4,99.38 47.62,96.84 26.09,96.84 27.3,96.84 62.23,98.74 67.31,99.38 66.23,99.25 66.87,100.27 60.96,96.84 62.23,97.47 60.96,98.11 59.69,97.47 67.94,100.65 86.93,81.85 79.69,86.8 85.53,84.84 83.57,82.87 86.68,77.79 86.93,82.87 87,83.95 86.55,87.12 81.47,86.8
  pour Top (isolate 0.254, rank 3): 68.58,100.33 67.94,100.97 15.88,100.97 14.92,100.01 14.92,92.17 15.99,91.11 19.53,91.11 22.41,92.08 24.66,92.04 25.58,91.12 27.61,91.12 28.02,91.54 35.14,91.54 35.56,91.12 38.73,91.12 39.23,91.62 44.76,91.64 45.39,90.81 53.34,90.81 55.24,92.08 55.62,92.4 55.67,92.4 56.08,92.8 56.08,95.76 56.52,96.2 61.91,96.2 64.77,99.06 67.31,99.06
  pour 15-SUPPLY (isolate 0.406, rank 2): 17.5,101 16.2,99.7 16.2,97 17.2,96 59.9,96 61.28,95.95 61.98,95.25 78.74,95.25 79.38,94.61 79.38,83.82 85.72,77.47 86.68,77.47 87.31,78.11 87.31,98.11 84.14,101.28 50.67,101.28 50.04,100.65 49.94,100.65
  pour Top (isolate 0.406): 87.44,86.68 87.25,86.8 87,87.06 79.82,87.06 79.31,86.55 79.31,84.45 79.69,84.07 82.99,84.07 83.82,83.25 83.82,76.64 83.38,76.2 82.61,76.2 80.45,74.04 80.45,73.47 82.49,73.47 83.38,72.45 84.07,72.45 88.07,76.45 88.07,86.04
+12V3  (via drill 0.38)
  Top 0.203: R58.2 49.85,76.07 v48.9,77.03
  Top 0.61: 65.96,93.52 C66.+
  Top 0.813: 81.03,100.9 80.96,100.97 79.57,100.97
  Top 1.27: D7.C 65.96,93.52
  Top 1.676: F4.P$2 74.23,96.52 | 74.23,96.52 73.66,96.52 72.39,95.25 D7.C | 74.23,96.52 78.11,100.39 79.57,100.39
  15-SUPPLY 0.203: v48.9,77.03 46.1,77.03 45.72,77.41 45.72,89.53 47.94,91.76 57.15,91.76 57.47,92.08 v60.33,92.08
  15-SUPPLY 1.27: X38.2 64.14,90.81 v62.23,92.71
  other vias: 59.05,95.25 59.05,93.98 61.28,94.81 60.2,95.19 59.18,92.9 78.04,94.68 78.04,92.77 78.04,91.88 77.09,91.95 76.2,91.95 78.04,93.73 76.96,94.68
  pour Top (isolate 0.406, rank 2): 59.44,95.5 58.8,94.87 58.8,92.65 59.31,92.14 61.28,92.14 62.23,91.19 67.88,91.19 68.39,90.68 80.2,90.68 81.22,91.69 81.22,101.03 81.15,101.16 77.47,101.16 74.49,98.17 67.18,98.17 65.98,96.96 63.69,96.96 62.23,95.5
  pour 15-SUPPLY (isolate 0.406): 60.2,96.01 57.53,96.01 56.71,95.19 56.71,92.14 56.96,91.88 61.21,91.88 62.1,91 67.82,91 68.14,90.68 77.98,90.68 78.8,91.5 78.8,94.36 78.36,94.81 61.4,94.81
AREF
  Top 0.203: U2.98 64.15,63.42 64.39,63.18 65.41,63.18 65.91,63.69 65.91,68.83 66.55,69.47 66.55,69.55 C6.1
BED-HEAT
  Top 0.203: U2.7 58.02,68.88 58.23,69.09 58.23,70.04 57.15,71.12 57.15,72.39 57.78,73.03 59.94,73.03 61.08,74.16 R56.1 R57.1
D+  (via drill 0.38)
  Top 0.191: R2.1 13.97,59.78 | 13.97,59.78 12.86,59.78 v12.64,60.01 | Z2.2 13.92,59.83 13.97,59.78
  Bottom 0.191: v12.64,60.01 11.75,60.9 10.29,60.9 X2.3
D-  (via drill 0.38)
  Top 0.191: Z1.2 13.84,58.42 13.97,58.55 v12.57,58.55
  Top 0.203: 13.97,58.55 15.05,58.55 R1.1
  Bottom 0.191: v12.57,58.55 12.18,58.55 X2.2
DP-SS  (via drill 0.38)
  Top 0.203: v46.49,40.7 46.49,40.46 44.58,38.54 44.58,37.85 44.83,37.59 46.86,37.59 47.05,37.78 48.05,37.78 U4.P05 | v47.05,51.61 47.05,52.38 U2.50
  Bottom 0.203: v46.49,40.7 44.83,42.36 44.83,50.07 46.37,51.61 v47.05,51.61
DTR
  Top 0.191: 27.05,58.42 30.12,58.42 RN5.5 30.99,58.03 31.18,57.85 31.18,55.31 31.43,55.05 32.32,55.05 32.51,55.24 32.51,56.58 32.64,56.71 JP2.1 | U10.3 30.61,51.75 30.73,51.88 30.73,54.1 31.18,54.55 32.77,54.55 33.02,54.8 33.27,54.8 JP2.2
  Top 0.203: U1.13 24.83,59.56 24.89,59.5 25.97,59.5 27.05,58.42 | JP2.2 JP2.1
E0-DIR  (via drill 0.38)
  Top 0.203: U2.41 48.35,56.92 48.76,57.34 54.41,57.34 54.67,57.59 v54.74,57.59 | U8.20 61.79,19.3 61.28,19.81 61.28,25.88 TP11.TP 62.08,28.18 v62.08,30 | v56.52,33.02 55.88,33.66 55.88,40.26 55.19,40.95 54.23,40.95 54.1,41.08 v53.98,41.21
  Bottom 0.203: v54.74,57.59 54.9,57.18 54.9,46.33 54.29,45.72 54.29,41.52 v53.98,41.21 | v56.52,33.02 59.85,29.69 61.75,29.69 61.91,29.84 v62.08,30
E0-EN  (via drill 0.38)
  Top 0.203: U2.74 60.52,49.27 61.98,47.82 61.98,44.01 62.93,43.05 v63.41,43.05 | U8.5 77.72,19.3 78.42,20 78.42,25.4 TP14.TP 77.08,27.12 R62.2 76.93,27.79 76.16,28.56 76.16,31.64 72.96,34.83 72.96,42.1 71.71,43.35 71.71,43.38 v71.61,43.48
  Bottom 0.203: v63.41,43.05 63.83,43.48 v71.61,43.48
E0-MS1
  Top 0.203: U2.86 66.6,57.42 68.52,55.5 68.52,53.09 66.23,50.8 66.23,47.88 72.45,41.66 72.45,33.08 70.8,31.43 70.8,31.45 70.6,31.25 U8.11
E0-MS2
  Top 0.203: U2.85 66.46,56.92 68.07,55.31 68.07,53.21 65.79,50.93 65.79,47.69 72.01,41.47 72.01,33.44 70.17,31.6 70.17,31.61 70.1,31.55 U8.12
E0-REF  (via drill 0.38)
  Top 0.203: U8.18 66.54,20.3 65.49,21.35 65.49,24.77 TP12.TP | U4.P17 52.76,35.85 v52.73,35.83
  Bottom 0.203: v52.73,35.83 52.8,35.79 54.48,34.1 54.48,33.47 59.18,28.77 63.44,28.77 64.59,27.61 TP12.TP
E0-STEP  (via drill 0.38)
  Top 0.203: U2.56 51.52,51.41 50.9,52.03 50.9,54.12 51.68,54.9 58.23,54.9 58.64,54.6 v58.6,54.6 | v67.41,53.5 67.25,52.96 65.34,51.05 65.34,47.5 71.5,41.34 71.5,33.84 68.86,31.2 64.68,31.2 64.02,30.54 64.02,27 64.22,26.8 65.11,26.8 TP13.TP 67.45,24.46 U8.17
  Bottom 0.203: v58.6,54.6 58.66,54.61 58.97,54.74 62.04,54.74 62.8,53.98 66.93,53.98 v67.41,53.5
E1-DIR  (via drill 0.38)
  Top 0.203: U2.42 48.48,56.42 49,56.94 57.1,56.94 59.37,59.21 v59.37,59.82 | U9.20 79.76,19.3 79.06,20 79.06,25.34 79.49,25.77 TP15.TP 79.49,30.3 78.8,30.99 77.41,30.99 73.47,34.93 73.47,42.61 66.67,49.4 66.67,50.67 68.96,52.96 68.96,55.75 66.71,58.01 v66.26,58.07
  Bottom 0.203: v66.26,58.07 64.52,59.82 v59.37,59.82
E1-EN  (via drill 0.38)
  Top 0.203: v73.72,45.53 75.37,43.88 75.37,35.46 78.09,32.75 92.98,32.75 98.61,27.11 98.61,20.64 97.35,19.37 R63.2 | U2.75 61.02,49.35 62.42,47.94 62.42,44.67 v62.96,44.13 | U9.5 97.02,19.3 97.28,19.56 97.26,19.37 R63.2 | TP18.TP 97.07,19.2 R63.2
  Bottom 0.203: v73.72,45.53 64.36,45.53 v62.96,44.13
E1-MS1
  Top 0.203: U9.11 88.38,30.05 86.11,32.31 77.89,32.31 74.93,35.27 74.93,43.12 69.85,48.2 69.85,56.13 66.86,59.12 65.72,59.12 65.02,58.42 U2.88
E1-MS2
  Top 0.203: U9.12 87.88,29.91 85.92,31.88 77.72,31.88 74.42,35.18 74.42,43.05 69.41,48.07 69.41,55.94 66.61,58.74 65.98,58.74 65.16,57.92 U2.87
E1-REF  (via drill 0.38)
  Top 0.203: 54.15,37.78 U4.P20 52.75,37.8 v52.73,37.83 | U9.18 84.47,20.3 83.25,21.53 TP17.TP
  Bottom 0.203: v52.73,37.83 54.93,35.63 54.93,33.59 59.31,29.21 79.58,29.21 TP17.TP
E1-STEP  (via drill 0.38)
  Top 0.203: U2.57 52.02,51.55 51.38,52.19 51.38,53.89 51.95,54.47 52.01,54.47 57.53,54.47 58.51,53.49 v58.51,52.45 | U9.17 85.23,21.45 85.03,21.65 85.03,25.78 84.14,26.67 81.47,26.67 81.15,26.48 TP16.TP 80.86,30.71 80.14,31.43 77.57,31.43 73.91,35.09 73.91,42.93 67.5,49.34 v67.5,50.55
  Bottom 0.203: v58.51,52.45 60.42,50.55 v67.5,50.55
FAN-0  (via drill 0.38)
  Top 0.203: R48.1 34.35,69.03 34.29,68.96 R49.1 34.61,68.71 v35.5,68.71 | U2.17 53.02,67.44 52.13,68.33 52.13,68.83 v52.01,68.96
  Bottom 0.203: 35.43,68.77 v35.5,68.71 36.51,67.69 46.29,67.69 46.67,67.31 50.35,67.31 v52.01,68.96
FAN-1
  Top 0.203: U2.15 54.02,67.59 53.25,68.35 53.25,69.75 52.07,70.93 52.07,72.39 51.44,73.03 49.21,73.03 48.39,72.2 R54.1 48.26,72.07 47.31,73.03 47.31,74.55 47.82,75.06 47.82,76.52 47.5,76.83 46.35,76.83 45.72,77.47 45.72,85.45 R53.1
FAN-2  (via drill 0.38)
  Top 0.203: U2.6 58.52,68.8 58.67,68.96 58.67,70.23 58.42,70.48 X34.4 58.42,71.69 | R70.1 40.81,73.66 v39.12,73.66 38.48,73.66 37.97,73.15 R71.1
  Bottom 0.203: X34.4 57.15,73.03 49.53,73.03 47.43,75.12 40.58,75.12 40.26,75.44 39.5,75.44 39.12,75.06 v39.12,73.66
GND  (via drill 0.38, 0.5, 0.5 pad 0.1, 0.6)  (682 unrouted)
  Top 0.203: R18.1 14.29,30.16 v14.27,30.42 | R12.1 v32.07,30.48 | 12.06,74.93 Q1.1 Q1.2 Q1.3 | 12.06,74.93 v11.87,74.74 v12.57,74.74 | v12.57,74.74 v13.27,74.74 v13.97,74.74 | v12.57,74.74 12.06,74.93 | v24.13,74.99 v22.86,74.99 v21.59,74.99 | 22.86,76.2 22.86,75.25 | Q3.3 Q3.2 Q3.1 | v33.02,74.93 v34.35,74.93 34.42,74.87 36.39,74.87 | Q5.3 Q5.2 Q5.1 | 53.98,75.25 v53.98,74.93 v53.02,74.93 | v57.78,73.98 v56.83,73.98 v55.88,73.98 | v55.88,73.98 v54.61,73.98 | v56.52,74.93 56.52,74.61 v55.88,73.98 | v52.84,33.03 53.24,33.26 U4.P13 55.23,33.26 55.44,33.47 55.44,35.18 | v68.9,18.1 v68.9,20 | v70.8,19.05 71.12,19.05 | v69.85,18.1 v70.8,18.1 | v86.68,18.1 U9.33 | U2.81 61.28,54.92 v60.78,55.43 | U2.62 54.52,49.48 55.99,48.01 58.8,48.01 | R54.2 48.67,73.47 52.83,73.47 53.28,73.91 53.34,73.91 | R52.2 36.39,74.87 | R43.2 10.79,68.87 10.83,68.83 v11.75,68.83 | U10.15 35.69,52.39 36.58,53.28 36.58,55.37 37.68,56.48 C69.2 37.67,56.48 v38.81,56.48 | U4.P03 48.06,39.12 46.89,39.12 C55.2 | U4.P24 55.16,40.41 55.44,40.13 55.44,38.61 | U4.P21 54.19,38.48 55.31,38.48 55.44,38.61 | U4.P16 55.4,35.2 55.44,35.18 | 55.44,35.18 55.44,38.61 | 46.04,38.32 C55.2 | D19.A 76.77,35.88 v76.07,35.88 | X29.1 89.53,44.45 89.64,44.35 v89.64,43.19 | X3.1 v90.11,36.58 | C56.2 80,46.55 v79.06,46.55 | 76.52,47.05 v76.52,47.76 76.52,48.52 D13.A | v82.74,41.03 81.82,41.03 C64.2 | v76.07,40.14 D17.A | v34.8,30.48 C36.1 | 58.8,48.01 59.73,47.08 | v58.8,47.97 58.84,48.01 58.8,48.01 | 42.71,62.95 42.69,62.93 v41.81,62.93 | LED1.C 1.84,73.6 | 1.84,73.6 v1.84,75.03 | LED7.C 1.84,70.86 1.84,73.6 | v68.58,30.38 68.58,29.49 R22.1 | v71.66,30.43 71.66,29.52 C46.1 | v89.47,30.43 89.47,29.61 C51.1
  Top 0.203: v86.39,30.38 86.39,29.46 R26.1 | U4.P04 46.17,38.45 C55.2 | v90.08,51.06 87.56,51.06 87.44,51.18 87.44,52.3 X28.1 | v90.52,61.6 87.7,61.6 87.44,61.34 87.44,60.23 X27.1 | C59.2 81.76,50.3 v82.8,50.3 | D12.A 71.37,50.53 v71.37,49.79 | C3.2 73.61,48.58 v74.68,48.58 | C6.2 68.48,69.8 v68.48,68.33 | 64.2,90.08 C62.2 64.2,89.85 | C52.2 54.1,69.44 54.31,69.23 v54.86,68.93 56.02,67.78 U2.11 | U2.99 64.84,63.92 v64.86,63.94 64.9,63.98 C26.2 | R71.2 36.33,74.81 36.39,74.87 | v49.67,30.63 49.67,29.96 C18.2 | v65.86,55.62 65.04,55.62 C8.2 | 41.53,57.09 41.53,56.33 41.66,56.2
  Top 0.254: U2.32 44.91,61.42 | 44.24,61.42 42.82,62.84 | 42.82,62.84 C9.2 | 42.82,62.84 42.71,62.95
  Top 0.305: 31.64,19.8 U6.33 | 69.1,19.8 U8.33 | 86.88,19.8 U9.33 | U5.33 13.22,19.8 11.5,19.8 | 44.91,61.42 44.24,61.42
  Top 0.406: 44.39,89.18 C60.2 44.3,89.31 v43.24,90.36 | C30.2 67.44,80.52 67.5,80.45
  Top 0.508: C24.2 12.44,29.49 v12.44,30.4 | C23.2 30.22,29.5 v30.22,30.44 | C17.2 66.77,29.52 v66.77,30.46 | v84.58,30.48 C4.2
  Top 0.61: C31.1 17.02,29.4 17.14,29.4 17.46,29.72 v17.46,30.35 | v45.34,38.32 46.04,38.32 | 64.2,89.85 64.39,89.79 v65.41,89.79
  Top 0.813: 7.11,17.34 7.11,18.41 C71.2 | 67.5,80.45 v67.5,78.61 | v68.58,80.52 67.56,80.52 67.5,80.58 v67.5,82.36 | C54.2 62.06,89.98 v62.93,89.98
  other vias: 51.47,30.44 54.34,29.43 90.08,33.79 91.35,58.93 31.75,74.93 30.92,76.07 9.84,101.92 93.03,0.95 103.19,75.88 39.27,63.25 44.07,33.23 53.02,75.88 55.24,74.93 53.34,73.98 95.76,20.07 74.68,78.93 0.95,68.26 75.31,76.14 74.28,31.23 11.59,10.79 12.22,10.79 16.35,10.79 15.72,10.79 30,10.79 30.64,10.79 34.13,10.79 34.77,10.79 49.69,10.79 50.32,10.79 53.82,10.79 54.45,10.79 67.47,10.79 68.1,10.79 71.6,10.79 72.23,10.79 85.25,10.79 85.88,10.79 89.38,10.79 90.01,10.79 88.58,19.05 86.68,19.05 88.58,18.1 87.63,18.1 86.68,20 87.63,20 88.58,20 68.9,19.05 13.97,20 14.92,20 13.02,20 14.92,19.05 13.02,19.05 13.02,18.1 13.97,18.1 14.92,18.1 32.38,20 33.34,20 31.43,20 33.34,19.05 31.43,19.05 31.43,18.1 32.38,18.1 33.34,18.1 52.07,20 53.02,20 51.12,20 53.02,19.05 51.12,19.05 51.12,18.1 52.07,18.1 53.02,18.1 95.76,67.78 93.56,67.38 95.76,64.32 98.56,66.08 95.76,74.49 95.76,77.91 95.66,84.72 95.76,87.95 98.42,86.38 98.48,76.22 92.97,76.12 93.98,45.76 95.5,46.27 95.49,48.03 92.44,48 92.44,47.17 92.44,46.28 95.52,47.16 93.56,64.74 10.64,42.55 3.34,40 51.47,48.19 52.35,4.34 90.49,101.92 74.87,73.28 93.08,86.38 74.61,99.57 70.17,99.57 72.39,101.03 73.66,101.03 71.12,101.03 74.93,101.03 69.85,101.03 74.3,101.92 73.03,101.92 71.75,101.92 75.56,101.92 65.41,74.3 69.85,19.05 69.85,20 70.8,20 87.63,19.05 52.07,19.05 32.38,19.05 13.97,19.05 11.65,8.51 12.29,8.51 15.72,8.51 16.35,8.51 30.64,8.51 30,8.51 34.77,8.51 34.13,8.51 48.42,9.53 47.91,9.14 54.13,8.45 67.91,8.32 68.36,7.81 71.91,8.51 85.25,8.32 85.88,8.32 89.95,8.32 89.31,8.32 4.76,18.1 90.3,21.91 84.14,21.91 84.14,24.13 90.3,24.45 90.3,25.91 82.23,20.64 82.23,22.54 80.96,24.19 80.33,22.54 80.33,20.64 77.15,24.45 75.25,24.45 77.15,22.54 75.25,22.54 77.15,20.64 75.25,20.64 72.52,24.45 72.52,21.91 66.36,21.91 64.45,22.54 64.45,20.64 62.42,24.32 62.55,22.54 62.55,20.64 59.37,20.64 59.37,22.54 59.37,24.45 57.47,24.45 57.47,22.54 57.47,20.64 54.8,21.91 54.8,24.45 48.58,21.91 46.04,22.54 46.04,20.64 47.31,13.65 47.31,16.19 40.32,24.45 40.32,22.54 38.42,24.45 38.42,22.54 40.32,20.64 38.42,20.64 36.51,16.19 37.15,11.75 37.15,9.84 37.15,7.94 35.24,21.91 35.24,24.45 28.89,21.91 26.99,22.54 26.99,20.64 25.08,24.45 25.08,22.54 25.08,20.64 21.27,24.45 19.37,24.45 21.27,22.54 21.27,20.64 19.37,22.54 19.37,20.64 16.64,21.91 16.64,24.45 8.57,8.57 8.57,10.48 6.67,10.48 8.57,12.38 6.67,12.38 4.76,12.38 6.67,14.29 4.76,14.29 6.67,16.19 4.76,16.19 8.57,20.64 6.67,20.64 4.76,20.64 10.48,21.91 6.67,22.54 4.76,22.54 6.67,24.45 4.76,24.45 43,49.64 40.72,52.05 70.61,74.23 42.16,77.09 43.12,77.98 44.01,77.09 41.72,87.38 41.72,84.65 40.83,85.28 48.65,55.65 39.59,61.34 38.7,58.1 35.08,47.69 41.56,57.09 43.72,58.1 44.1,61.28 52.64,40.42 0.95,72.26 0.95,75.83 0.95,79.83 0.95,83.83 0.95,87.83 0.95,91.83 0.95,95.83 5.84,101.92 13.84,101.92 17.84,101.92 21.84,101.92 25.84,101.92 29.84,101.92 33.84,101.92 37.84,101.92 41.84,101.92 45.84,101.92 49.84,101.92 53.84,101.92 57.84,101.92 61.84,101.92 65.84,101.92 69.84,101.92 77.41,101.93 81.85,101.93 86.49,101.92 94.49,101.92 98.49,101.92 103.19,79.88 103.19,83.88 103.19,87.88 103.19,91.88 103.19,95.88 103.19,71.88 103.19,67.88 103.19,63.88 103.19,59.88 103.19,55.88 103.19,51.88 103.19,47.88 103.19,43.88 103.19,39.88 103.19,35.88 103.19,31.88 103.19,27.88 103.19,23.88 103.19,19.88 103.19,15.88 103.19,11.88 103.19,7.88 97.03,0.95 89.03,0.95 85.03,0.95 81.03,0.95 77.03,0.95 73.03,0.95 69.03,0.95 65.03,0.95 61.03,0.95 57.03,0.95 53.03,0.95 49.03,0.95 45.03,0.95 41.03,0.95 37.03,0.95 33.03,0.95 29.03,0.95 25.03,0.95 21.03,0.95 17.03,0.95 13.03,0.95 9.03,0.95 1.02,45.86 1.02,5.86 1.02,9.86 1.02,13.86 1.02,17.86 1.02,21.86 1.02,25.86 1.02,29.86 1.02,33.86 1.02,37.86 1.02,41.86 5.03,0.95 35.21,53.78 4.76,80.65 74.87,70.1 38.42,16.19 40.32,16.19 44.13,20.64 44.13,22.54 44.13,24.45 46.04,24.45 35.34,65.85 61.5,58.52 58.9,55.98 60.23,63.15 57.5,60.04 50.07,52.42 94.02,48.51 88.14,31.88 92.46,20.07 43.5,16.19 45.4,16.19 45.4,14.29 43.5,14.29 43.5,12.38 45.4,12.38 40.32,14.29 38.42,14.29 38.42,12.38 40.32,12.38 40.32,10.48 38.42,10.48 38.42,8.57 40.32,8.57 43.5,10.48 45.4,10.48 43.5,8.57 21.27,16.19 19.37,16.19 18.1,16.83 19.37,14.29 21.27,14.29 19.37,12.38 21.27,12.38 21.27,10.48 19.37,10.48 19.37,8.57 21.27,8.57 26.99,16.19 25.08,16.19 26.99,14.29 26.99,12.38 26.99,10.48 26.99,8.57 25.08,14.29 25.08,12.38 25.08,10.48 25.08,8.57 64.45,16.19 62.55,16.19 64.45,14.29 64.45,12.38 64.45,10.48 62.55,10.48 62.55,12.38 62.55,14.29 59.37,16.19 57.47,16.19 57.47,14.29 57.47,12.38 57.47,10.48 57.47,8.57 59.37,14.29 59.37,12.38 59.37,10.48 59.37,8.57 62.55,8.57 64.45,8.57 77.15,16.19 75.25,16.19 75.25,14.29 77.15,14.29 75.25,12.38 77.15,12.38 77.15,10.48 75.25,10.48 77.15,8.57 80.33,16.19 82.23,16.19 82.23,14.29 80.33,14.29 80.33,12.38 80.33,10.48 80.33,8.57 82.23,8.57 82.23,10.48 82.23,12.38 8.57,14.29 8.57,16.19 92.2,22.54 92.2,24.45 92.2,26.35 94.11,22.54 94.11,24.45 94.11,26.35 96.01,26.35 92.2,16.19 94.11,16.19 92.2,14.29 94.11,14.29 92.84,12.38 92.84,10.48 96.01,16.19 96.01,14.29 97.92,16.19 28.26,16.83 28.89,24.45 10.48,24.45 26.99,24.45 8.57,22.54 37.15,14.29 9.84,16.19 56.2,16.83 48.58,23.81 66.36,23.81 94.74,12.38 94.74,10.48 70.93,77.85 73.41,71.5 76.39,71.56 76.45,70.17 76.45,72.96 81.72,88.07 81.72,91 83.12,80.71 81.66,82.36 81.66,78.99 83.19,77.34 68.96,89.73 7.81,75.83 7.05,70.37 23.81,27.56 52.8,65.12 66.42,97.35 90.55,80.84 75.95,75.5 74.68,75.5 74.68,76.77 75.95,76.77 95.1,17.18 79.82,17.21 77.66,17.21 62.09,17.21 60.01,17.21 43.29,17.21 41.14,17.21 24.24,17.21 22.09,17.21 6.72,18.4
  pour 2-GND (isolate 0.203, rank 2): 0,102.87 0,0 104.14,0 104.14,102.87
  pour Bottom (isolate 0.203, rank 3): 0,102.87 0,0 104.14,0 104.14,102.87
  pour Bottom (isolate 0.406, rank 2): 91.44,88.9 99.06,88.9 99.06,63.5 91.44,63.5
  pour Top (isolate 0.203, rank 3, no thermals): 86.04,69.22 66.48,69.22 66.48,90.04 86.04,90.04
  pour Top (isolate 0.203, rank 4): 19.48,102.87 19.57,102.87 19.66,102.87 104.2,102.87 104.14,40.01 104.17,0 0,0 0,102.85
  pour 15-SUPPLY (isolate 0.203, rank 4): 0,102.87 104.14,102.87 104.14,0 0,0
  pour Top (no thermals): 92.24,45.84 95.41,45.84 96.05,46.48 96.05,48.07 95.73,48.38 92.24,48.38 91.92,48.07 91.92,46.16
GND1  (via drill 0.38)
  Top 0.203: U1.33 21.46,59.24 v20.51,58.36 20.16,58.1 20.7,58.1 20.71,58.09 U1.3 20.71,55.02 20.9,54.84 20.9,54.14 | 19.56,51.33 Y2.2 19.65,51.24 | U10.4 28.77,51.12 28.64,50.99 28.19,50.99 28,51.18 | U10.2 28.41,52.39 C70.2
  Top 0.61: C12.2 19.65,51.24
  other vias: 17.53,59.88 17.21,56.58 18.8,54.99 20.52,60.26 14.93,60.9 15.24,56.96 16.71,52.39 18.36,50.23 18.99,48.32 22.17,48.32 21.72,52.64 24.07,50.23 18.74,52.39 25.4,51.94 28.33,48.32 28.01,51.12 9.09,62.23 7.31,60.26 8.64,55.24 33.28,64.83 26.87,66.48 0.96,65.47 0.96,48.32 13.15,65.53 11.69,48.26 7.82,48.32 4.13,65.47 34.42,57.98 0.96,52.32 0.96,56.32 0.96,60.32 0.96,64.32 29.98,54.29
  pour 15-SUPPLY: 6.35,60.33 6.35,56.52 8.26,54.61 13.97,54.61 15.88,56.52 15.88,60.33 13.34,62.87 8.89,62.87
  pour 2-GND (isolate 0.203): 0.06,66.67 10.79,66.67 12.45,68.33 12.45,69.53 12.95,70.04 12.95,71.37 13.65,72.07 33.34,72.07 33.97,71.44 33.97,66.29 35.43,64.83 35.43,54.61 34.16,53.34 34.16,47.82 33.59,47.24 0.06,47.24
  pour Top (isolate 0.203): 0.06,67.56 12.45,67.56 13.59,66.61 13.59,71.37 14.29,72.07 32.7,71.44 33.34,70.8 33.34,65.66 34.8,64.2 34.8,54.29 34.16,53.66 32.89,53.66 32.13,52.9 32.13,48.45 31.56,47.88 0.06,47.88
  pour Bottom (isolate 0.203, rank 2): 0.06,66.04 13.97,66.04 15.24,67.31 15.24,69.85 16.19,70.8 32.7,70.8 33.34,70.17 33.34,65.66 34.8,64.2 34.8,54.55 34.23,53.98 32.89,53.98 32.13,53.21 32.13,47.82 31.56,47.24 0.06,47.24
  pour 15-SUPPLY (isolate 0.203): 0.06,66.67 13.65,66.67 13.65,47.05 0.06,47.05
HEAT-0  (via drill 0.38)
  Top 0.203: v50.45,69.69 50.64,69.25 52.52,67.37 U2.18 | R42.1 16.83,74.13 | R43.1 9.08,68.94 9.08,71.37 9.59,71.88 12.7,71.88 13.96,73.14 16.56,73.14 16.83,73.41 16.83,74.14 R42.1 | v16.95,75.11 16.95,74.27 R42.1
  Bottom 0.203: v50.45,69.69 50.04,70.1 48.26,70.1 47.88,70.48 47.88,72.52 46.42,73.98 40.64,73.98 39.62,72.96 38.61,72.96 37.4,74.17 17.89,74.17 v16.95,75.11
HEAT-1  (via drill 0.38)
  Top 0.203: R51.1 R52.1 39.2,74.61 v39.88,74.61 | U2.16 53.52,67.52 52.82,68.21 52.82,69.48 51.82,70.48 49.02,70.48 v48.64,70.87
  Bottom 0.203: v48.64,70.87 48.64,72.71 46.74,74.61 v39.88,74.61
L13  (via drill 0.38)
  Top 0.203: U2.26 47,64.44 v47,68.1 | v7.68,73.66 7.56,73.66 6.16,72.26 5.96,72.26 R33.1
  Bottom 0.203: v47,68.1 47.54,67.94 49.97,67.94 50.54,68.51 | X34.3 55.69,71.56 55.31,71.56 54.23,70.48 52.51,70.48 50.54,68.51 | v7.68,73.66 37.34,73.66 38.42,72.58 39.81,72.58 40.77,73.53 46.23,73.53 47.37,72.39 47.37,70.36 48.07,69.66 49.41,69.66 50.54,68.53 50.54,68.51
MISO2  (via drill 0.38)
  Top 0.203: U1.17 23.91,61.76 v24.32,61.98
  Bottom 0.203: v24.32,61.98 24.32,58.36 24.77,57.91 25.97,57.91 27.5,59.44 27.5,59.88 X17.1
MOSI2
  Top 0.203: U1.16 24.67,61.06 25.02,61.4 29.02,61.4 X17.4
N$1
  Top 0.203: U5.10 15.22,25.25 16.83,26.86 16.83,27.47 C31.2
N$2
  Top 0.203: LED1.A 5.68,73.59 R33.2
N$3
  Top 0.203: R35.2 4.28,70.42 LED7.A
N$4
  Top 0.254: U6.32 34.13,15.61
  Top 0.305: 33.97,15.46 34.13,15.61
  Top 1.016: R8.1 33.97,13.17 33.97,15.46
N$5
  Top 0.254: U6.25 30.64,15.57
  Top 0.305: 30.8,15.42 30.64,15.57
  Top 1.016: R10.1 30.8,13.17 30.8,15.42
N$6
  Top 0.203: U6.8 36.17,20.8 36.6,21.23 36.6,26.06 37.53,26.99 37.53,28.5 38.4,29.38 C33.2
N$7
  Top 0.203: U6.9 34.13,25.63 35.31,26.8 35.62,26.8 36.6,27.77 C32.2
N$8
  Top 0.203: U6.10 33.63,25.82 34.35,26.54 34.35,27.5 34.58,27.73 C36.2
N$9
  Top 0.203: U6.14 31.64,27.32 R12.2
N$10
  Top 0.203: R53.2 42.91,85.72 Q4.1
N$11
  Top 0.191: LED10.A 29.67,56.43 RN5.7
N$12
  Top 0.203: U5.15 12.72,27.55 C24.1 12.54,27.77 13.34,28.57 14.92,28.57 15.24,28.26 15.24,27.05 13.72,25.53 U5.13 | U5.16 12.22,22.16 12.15,22.24
  Top 0.508: C24.1 12.06,27.73 | 12.06,27.73 12,27.75 R29.1 | 12.15,22.24 12.15,27.68 12.06,27.73
N$13  (via drill 0.38)
  other vias: 99.12,47.94 98.23,50.8 95.89,51.12 100.65,53.47 93.22,59.12 100.08,59.07 97.21,59.1 95.08,59.05 98.72,59.05
  pour Top (isolate 0.406): 98.74,47.62 100.65,47.62 101.92,48.9 101.92,61.59 100.33,63.18 93.34,63.18 92.71,62.55 92.71,53.66
  pour 15-SUPPLY (isolate 0.406): 100.01,59.46 100.33,59.46 101.92,57.88 101.92,48.9 100.65,47.62 98.74,47.62 92.71,53.66 92.71,58.93 93.34,59.56
N$14
  Top 0.813: 93.34,71.12 92.08,72.39 F3.P$1
  Top 1.778: X33.3 93.34,71.12
  pour Top (isolate 0.254): 88.27,70.48 90.17,74.3 90.81,74.93 93.98,74.93 95,73.91 97.54,73.91 99.06,72.39 99.06,69.85 98.42,69.22 89.53,69.22
  pour Top (isolate 0.406, no thermals): 85.72,70.48 85.72,73.09 87.63,74.99 92.08,74.99 92.08,69.85 91.44,69.22 87,69.22
N$15  (via drill 0.38)
  Top 0.305: JP3.2 88.7,87.31 R3.1
  Top 0.559: U3.5 79.06,74.23
  Top 0.61: 79.06,74.23 v79.38,73.91
  Bottom 0.203: v79.38,73.91 85.28,73.91 87.57,76.2 87.57,81.03 87.82,81.28 87.82,84.77 JP3.2
N$16  (via drill 0.38)
  Top 0.813: X33.5 100.33,85.85 100.33,87.63 v94.61,93.34 93.09,93.34 | 91.95,93.34 93.09,93.34 | 93.09,93.34 F4.P$1 | 94.23,100.33 91.69,100.33
  other vias: 99.06,80.64 100.33,80.01 100.33,81.28 99.06,81.92 94.61,83.19 100.33,82.55 93.34,82.55 98.42,83.19 97.16,83.19 95.89,83.19 93.22,90.74 94.55,90.74 94.61,96.52 91.44,96.52 91.63,100.2 92.08,90.74 93.09,97.03 91.44,92.08 94.61,100.33 91.63,93.28 93.09,96.01
  pour 15-SUPPLY (isolate 0.406): 91.88,101.41 90.17,99.69 90.17,92.71 91.44,91.44 91.44,86.8 92.77,85.47 92.77,79.95 93.34,79.38 100.97,79.38 102.62,81.03 102.55,95.57 102.04,96.08 99.38,96.08 97.35,98.11 97.35,100.46 96.39,101.41
  pour Top: 91.88,100.52 90.17,98.81 90.17,92.71 91.44,91.44 91.44,86.8 92.77,85.47 92.77,79.95 93.34,79.38 100.97,79.38 102.23,80.64 102.23,90.81 98.42,94.61 97.16,94.61 96.52,95.25 96.58,99.12 95.19,100.52
N$17
  Top 0.254: U6.30 33.13,15.86
  Top 0.305: 32.89,15.59 33.13,15.86
  Top 0.61: 32.89,15.59 32.89,6.66 31.8,5.6 31.8,4.77 X4.2
N$19
  Top 0.254: U6.27 31.64,15.89
  Top 0.305: 32.04,15.59 31.64,15.89
  Top 0.61: 32.04,15.59 32.04,8.28 29.4,5.8 29.4,4.91 X4.3
N$20
  Top 0.254: 29.68,16.73 29.98,17.03 U6.24
  Top 0.305: 29.69,16.66 29.68,16.73
  Top 0.61: 29.69,16.66 29.69,14.43 28.73,13.47 28.73,7.83 26.6,5.7 X4.4
N$21  (via drill 0.38, 0.5)
  Top 0.203: LED2.C 11.75,73.72 11.11,74.36 11.11,75.98 D6.A
  other vias: 13.97,78.11 14.92,78.11 15.88,78.11 15.88,79.06 14.92,79.06 13.97,79.06 13.97,80.01 14.92,80.01 15.88,80.01 15.88,80.96 14.92,80.96 13.97,80.96 13.02,80.96 12.06,80.96 12.06,80.01 13.02,80.01 13.02,79.06 12.06,79.06 12.06,78.11 13.02,78.11 13.97,82.55 15.88,82.55 12.06,82.55 10.16,82.55 8.26,82.55 8.26,80.64 10.16,80.64 9.53,79.38 17.78,82.55 17.78,80.64 17.78,84.45 15.88,84.45 13.97,84.45 12.06,84.45 10.16,84.45 8.26,84.45 8.26,86.36 10.16,86.36 12.06,86.36 13.97,86.36 15.88,86.36 15.88,88.27 13.97,88.27 12.06,88.27 10.16,88.27 8.26,88.27 10.16,90.17 8.26,90.17 12.06,90.17 13.97,90.17 15.88,90.17
  pour Bottom (isolate 0.254): 20.64,77.15 20.64,89.85 19.37,91.12 19.37,97.47 19.05,97.79 17.14,97.79 16.32,97.06 14.29,97.16 10.79,97.16 9.53,95.89 9.53,91.76 8.57,90.81 7.62,90.81 6.35,89.53 6.35,77.15 6.67,76.83 20.32,76.83
  pour Top (isolate 0.254): 20.2,77.79 20.2,89.85 19.59,90.47 19.58,90.47 18.59,91.46 9.96,91.56 8.57,90.17 7.62,90.17 6.35,88.9 6.35,77.79 6.67,77.47 19.89,77.47
  pour Top (no thermals): 10.16,78.74 10.16,77.47 17.3,77.47 17.46,77.63 17.46,82.39 10.16,82.39
N$22
  Top 0.254: 15.72,15.72 U5.32
  Top 0.305: 15.56,15.4 15.72,15.72
  Top 1.016: R4.1 15.56,13.01 15.56,15.4
N$23
  Top 0.254: 34.98,16.78 34.78,16.98 U6.1
  Top 0.305: 35.08,16.63 34.98,16.78
  Top 0.61: 35.08,16.63 35.08,14.4 36.04,13.45 36.04,7.34 34.2,5.5 34.2,4.67 X4.1
N$24
  Top 0.203: C33.1 38.1,27.38 38.1,26.92 37.08,25.91 37.08,21.08 36.3,20.3 U6.7
N$25
  Top 0.203: 31.14,28.36 U6.15 | U6.13 32.13,26.17 33.02,27.05 33.02,28.38 32.83,28.57 31.35,28.57 31.14,28.36 | 31.14,28.36 30.87,28.36 30.28,27.77 C23.1 30.23,27.5 | U6.16 30.64,22.11 30.5,22.24
  Top 0.508: 30.23,27.5 30.5,27.23 30.5,22.24 | C23.1 28.41,27.77 R65.1
N$26
  Top 0.203: Q2.4 25.7,76.39 26.04,76.39 26.35,76.71 27.3,76.71 27.94,76.07 29.15,76.07 30.54,74.68 30.54,72.96 30.92,72.58 33.53,72.58 33.91,72.2 34.09,72.2 R48.2
N$27
  Top 0.203: U2.100 62.93,64.51 62.93,64.83
  Top 0.406: L2.2 64.86,66.68 C26.1 64.74,66.48 64.52,66.42 62.93,64.83
N$28
  Top 0.254: 53.66,15.46 53.82,15.62 U7.32
  Top 1.016: R14.1 53.66,13.17 53.66,15.46
N$29
  Top 0.254: 50.32,15.59 U7.25
  Top 0.305: 50.48,15.43 50.32,15.59
  Top 1.016: R15.1 50.48,13.17 50.48,15.43
N$30